# EAGLE design RF-INP-001 (EAGLE 9.6.2)
DOCNUM: RF-INP-001; DWBY: Lewis Russell; DWDATE: 2/2/2021; DWINIT: LR; REV: 001; TITLE: RF Amplfier Input Filter

## Sheet 1 of 4: System Architecture
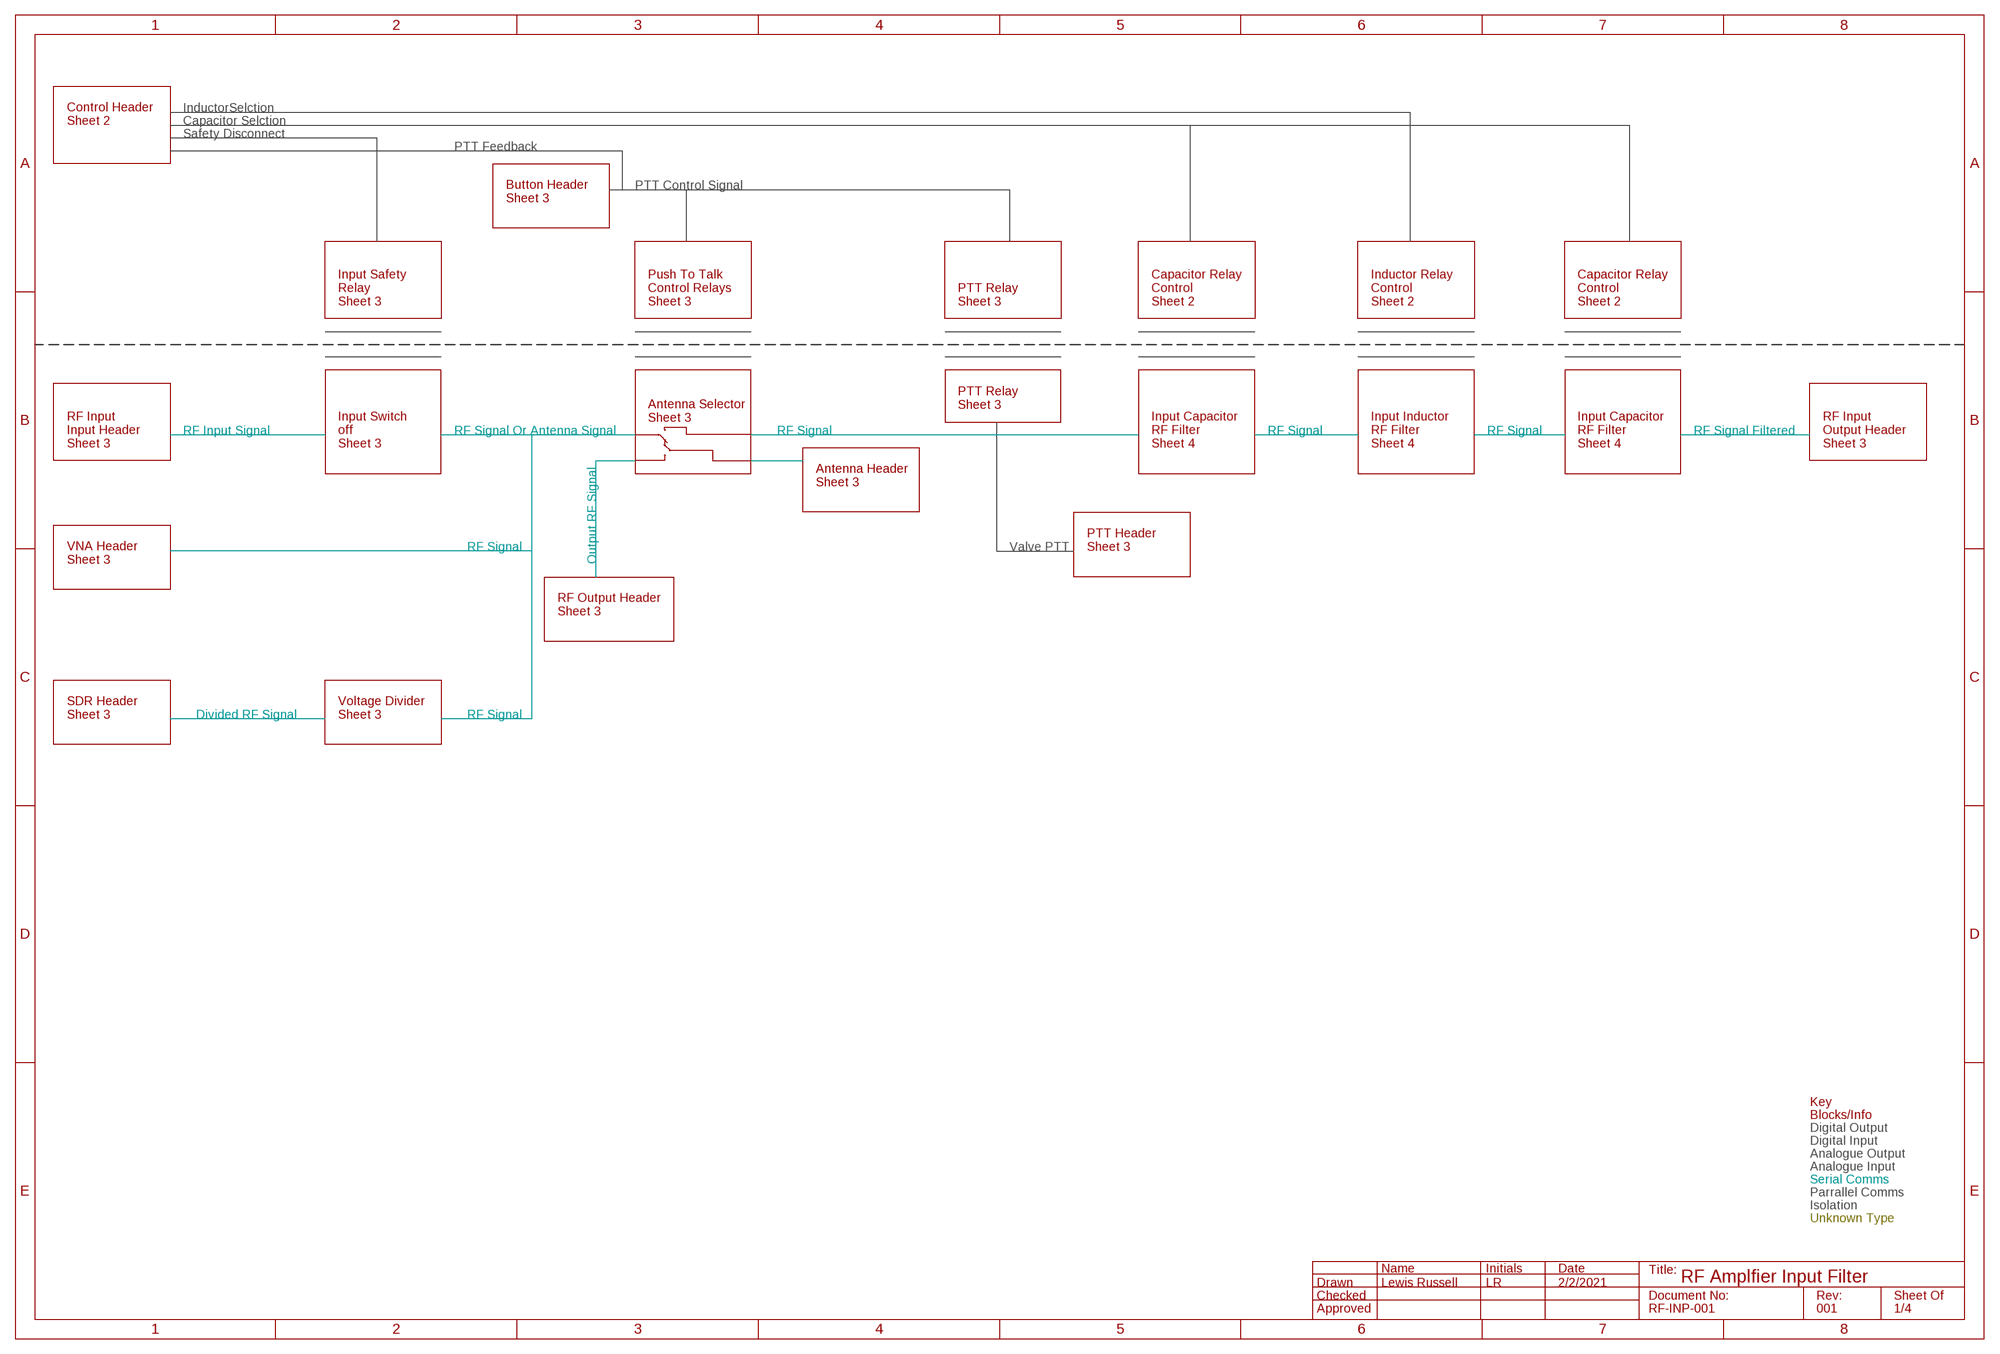
[diagram p0: schematic, sheet 1]

### Notes on the sheet
- InductorSelction
- Control Header
  Sheet 2
- Capacitor Selction
- Safety Disconnect
- PTT Feedback
- PTT Control Signal
- Button Header
  Sheet 3
- Input Safety
  Relay
  Sheet 3
- Push To Talk
  Control Relays
  Sheet 3
- PTT Relay
  Sheet 3
- Capacitor Relay
  Control
  Sheet 2
- Inductor Relay
  Control
  Sheet 2
- Capacitor Relay
  Control
  Sheet 2
- PTT Relay
  Sheet 3
- Antenna Selector
  Sheet 3
- RF Input Signal | RF Signal Or Antenna Signal | RF Signal | RF Signal | RF Signal | RF Signal Filtered
- RF Input 
  Input Header
  Sheet 3
- Input Switch
  off
  Sheet 3
- Input Capacitor
  RF Filter
  Sheet 4
- Input Inductor
  RF Filter
  Sheet 4
- Input Capacitor
  RF Filter
  Sheet 4
- RF Input
  Output Header
  Sheet 3
- Antenna Header
  Sheet 3
- RF Signal | Valve PTT
- PTT Header
  Sheet 3
- VNA Header
  Sheet 3
- Output RF Signal
- RF Output Header
  Sheet 3
- SDR Header
  Sheet 3
- Divided RF Signal
- Voltage Divider
  Sheet 3
- RF Signal
- Key
- Blocks/Info
- Digital Output
- Digital Input
- Analogue Output
- Analogue Input
- Serial Comms
- Parrallel Comms
- Isolation
- Unknown Type

## Sheet 2 of 4: Input Relay Control
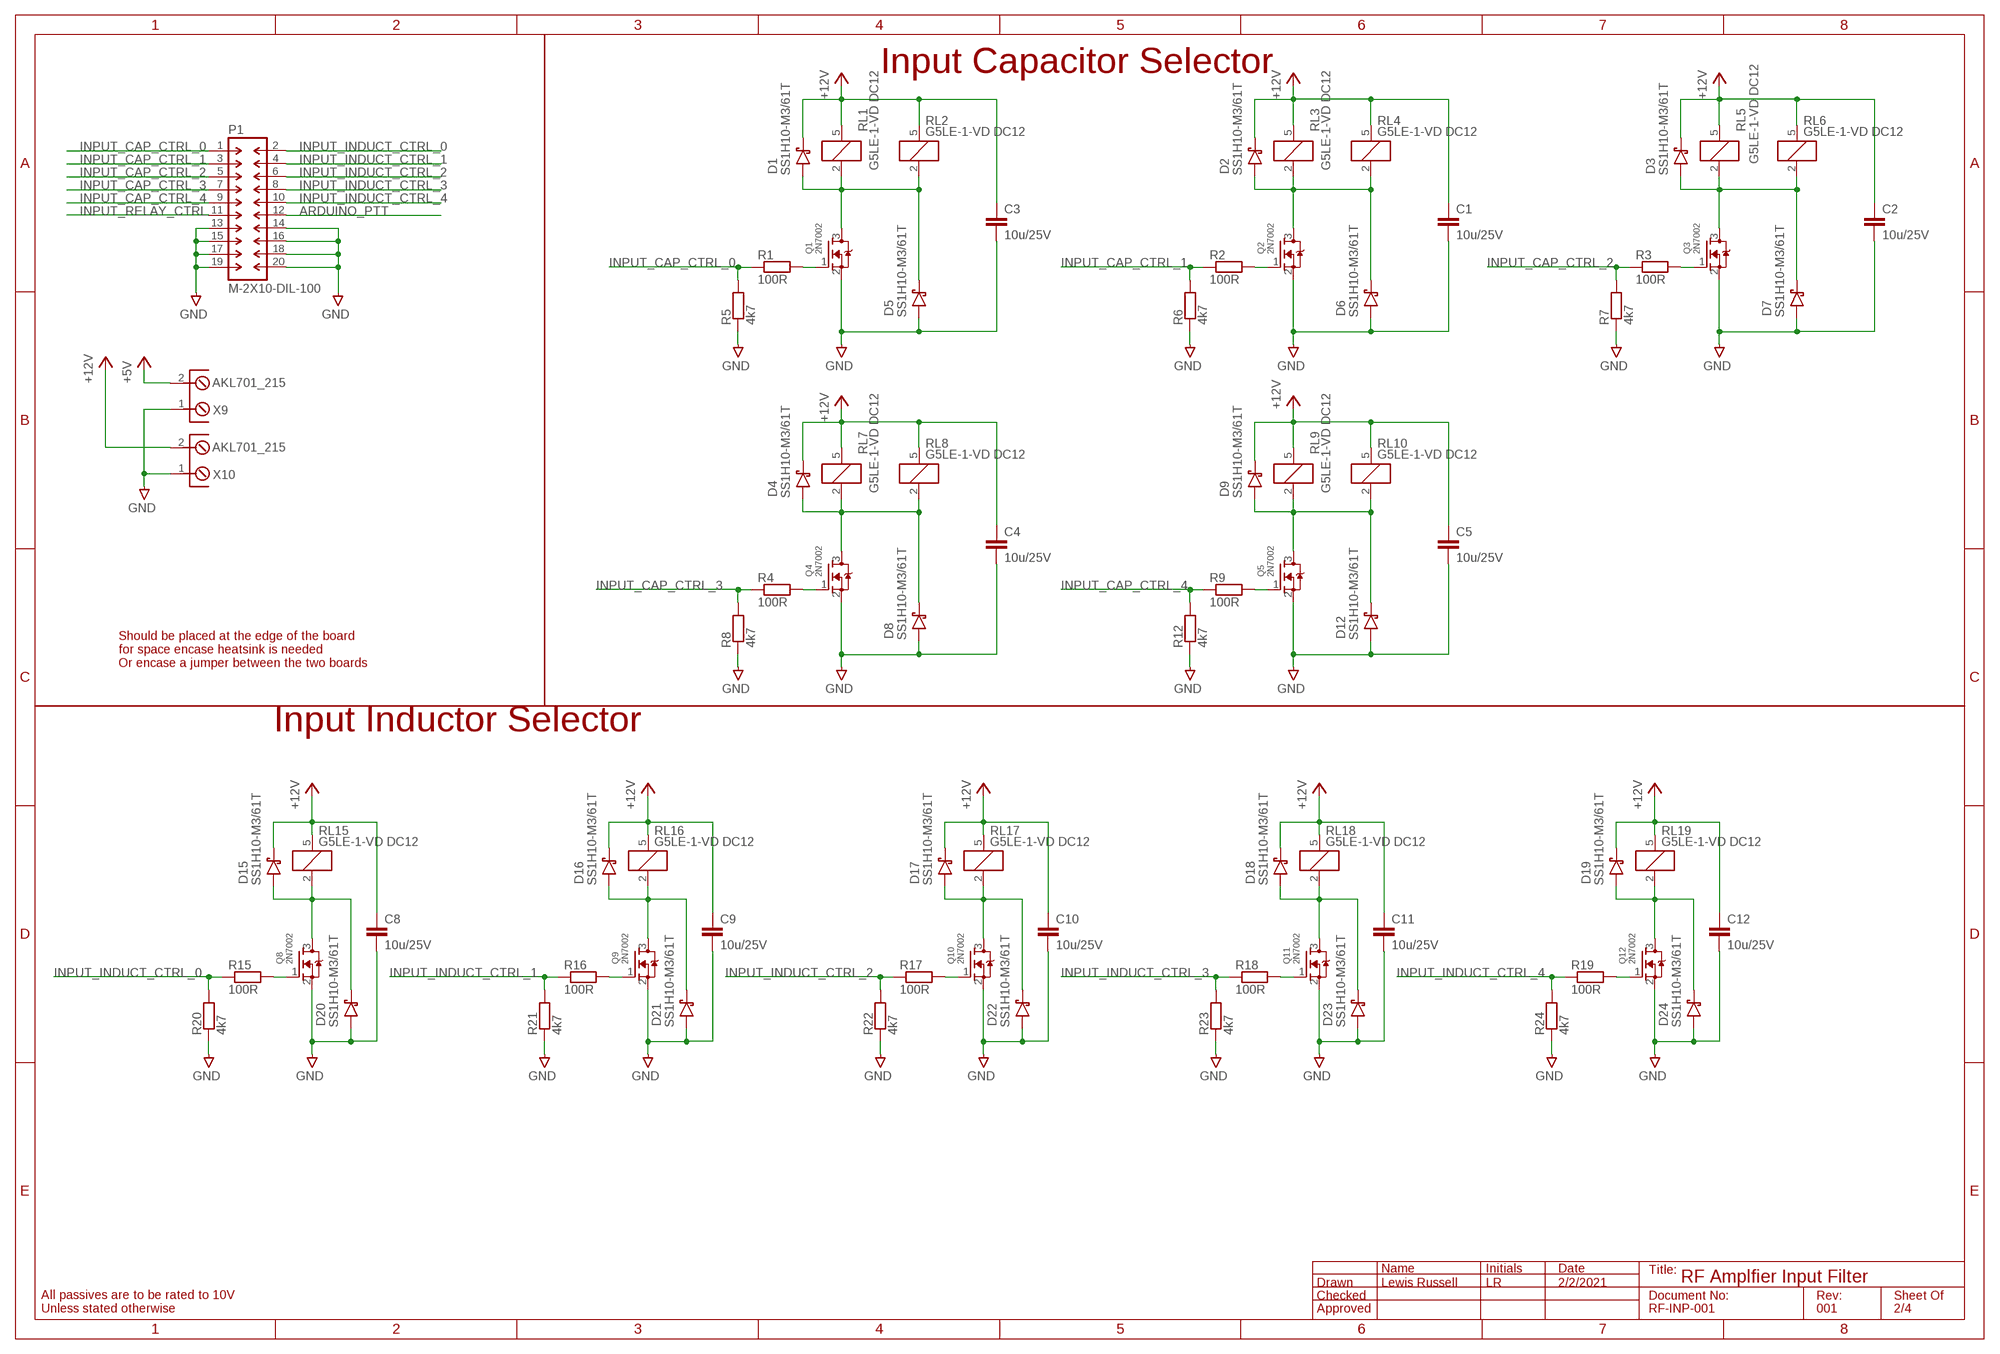
[diagram p1: schematic, sheet 2]

### Parts
C1  10u/25V  C-EUC0805  [C0805]
C2  10u/25V  C-EUC0805  [C0805]
C3  10u/25V  C-EUC0805  [C0805]
C4  10u/25V  C-EUC0805  [C0805]
C5  10u/25V  C-EUC0805  [C0805]
C8  10u/25V  C-EUC0805  [C0805]
C9  10u/25V  C-EUC0805  [C0805]
C10  10u/25V  C-EUC0805  [C0805]
C11  10u/25V  C-EUC0805  [C0805]
C12  10u/25V  C-EUC0805  [C0805]
D1  SS1H10-M3/61T  SCHOTTKY_DIODESMA  [SMA/DO-214AC]
D2  SS1H10-M3/61T  SCHOTTKY_DIODESMA  [SMA/DO-214AC]
D3  SS1H10-M3/61T  SCHOTTKY_DIODESMA  [SMA/DO-214AC]
D4  SS1H10-M3/61T  SCHOTTKY_DIODESMA  [SMA/DO-214AC]
D5  SS1H10-M3/61T  SCHOTTKY_DIODESMA  [SMA/DO-214AC]
D6  SS1H10-M3/61T  SCHOTTKY_DIODESMA  [SMA/DO-214AC]
D7  SS1H10-M3/61T  SCHOTTKY_DIODESMA  [SMA/DO-214AC]
D8  SS1H10-M3/61T  SCHOTTKY_DIODESMA  [SMA/DO-214AC]
D9  SS1H10-M3/61T  SCHOTTKY_DIODESMA  [SMA/DO-214AC]
D12  SS1H10-M3/61T  SCHOTTKY_DIODESMA  [SMA/DO-214AC]
D15  SS1H10-M3/61T  SCHOTTKY_DIODESMA  [SMA/DO-214AC]
D16  SS1H10-M3/61T  SCHOTTKY_DIODESMA  [SMA/DO-214AC]
D17  SS1H10-M3/61T  SCHOTTKY_DIODESMA  [SMA/DO-214AC]
D18  SS1H10-M3/61T  SCHOTTKY_DIODESMA  [SMA/DO-214AC]
D19  SS1H10-M3/61T  SCHOTTKY_DIODESMA  [SMA/DO-214AC]
D20  SS1H10-M3/61T  SCHOTTKY_DIODESMA  [SMA/DO-214AC]
D21  SS1H10-M3/61T  SCHOTTKY_DIODESMA  [SMA/DO-214AC]
D22  SS1H10-M3/61T  SCHOTTKY_DIODESMA  [SMA/DO-214AC]
D23  SS1H10-M3/61T  SCHOTTKY_DIODESMA  [SMA/DO-214AC]
D24  SS1H10-M3/61T  SCHOTTKY_DIODESMA  [SMA/DO-214AC]
P1  M-2X10-DIL-100  [DIL-100-2X10]
Q1  2N7002  MOSFET-NREFLOW  [SOT23]
Q2  2N7002  MOSFET-NREFLOW  [SOT23]
Q3  2N7002  MOSFET-NREFLOW  [SOT23]
Q4  2N7002  MOSFET-NREFLOW  [SOT23]
Q5  2N7002  MOSFET-NREFLOW  [SOT23]
Q8  2N7002  MOSFET-NREFLOW  [SOT23]
Q9  2N7002  MOSFET-NREFLOW  [SOT23]
Q10  2N7002  MOSFET-NREFLOW  [SOT23]
Q11  2N7002  MOSFET-NREFLOW  [SOT23]
Q12  2N7002  MOSFET-NREFLOW  [SOT23]
R1  100R  R-EUR0603  [R0603]
R2  100R  R-EUR0603  [R0603]
R3  100R  R-EUR0603  [R0603]
R4  100R  R-EUR0603  [R0603]
R5  4k7  R-EUR0603  [R0603]
R6  4k7  R-EUR0603  [R0603]
R7  4k7  R-EUR0603  [R0603]
R8  4k7  R-EUR0603  [R0603]
R9  100R  R-EUR0603  [R0603]
R12  4k7  R-EUR0603  [R0603]
R15  100R  R-EUR0603  [R0603]
R16  100R  R-EUR0603  [R0603]
R17  100R  R-EUR0603  [R0603]
R18  100R  R-EUR0603  [R0603]
R19  100R  R-EUR0603  [R0603]
R20  4k7  R-EUR0603  [R0603]
R21  4k7  R-EUR0603  [R0603]
R22  4k7  R-EUR0603  [R0603]
R23  4k7  R-EUR0603  [R0603]
R24  4k7  R-EUR0603  [R0603]
RL1  G5LE-1-VD DC12  G5LE-E  [SPDT]
RL2  G5LE-1-VD DC12  G5LE-E  [SPDT]
RL3  G5LE-1-VD DC12  G5LE-E  [SPDT]
RL4  G5LE-1-VD DC12  G5LE-E  [SPDT]
RL5  G5LE-1-VD DC12  G5LE-E  [SPDT]
RL6  G5LE-1-VD DC12  G5LE-E  [SPDT]
RL7  G5LE-1-VD DC12  G5LE-E  [SPDT]
RL8  G5LE-1-VD DC12  G5LE-E  [SPDT]
RL9  G5LE-1-VD DC12  G5LE-E  [SPDT]
RL10  G5LE-1-VD DC12  G5LE-E  [SPDT]
RL15  G5LE-1-VD DC12  G5LE-E  [SPDT]
RL16  G5LE-1-VD DC12  G5LE-E  [SPDT]
RL17  G5LE-1-VD DC12  G5LE-E  [SPDT]
RL18  G5LE-1-VD DC12  G5LE-E  [SPDT]
RL19  G5LE-1-VD DC12  G5LE-E  [SPDT]
X9  AKL701_215  [AKL701_2_15]
X10  AKL701_215  [AKL701_2_15]

### Nets
+5V [GND Signal]: X9.2 ; also sheet 3
+12V [GND Signal]: C1.1 C2.1 C3.1 C4.1 C5.1 C8.1 C9.1 C10.1 C11.1 C12.1 D1.C(CATHODE) D2.C(CATHODE) D3.C(CATHODE) D4.C(CATHODE) D9.C(CATHODE) D15.C(CATHODE) D16.C(CATHODE) D17.C(CATHODE) D18.C(CATHODE) D19.C(CATHODE) RL1.5 RL2.5 RL3.5 RL4.5 RL5.5 RL6.5 RL7.5 RL8.5 RL9.5 RL10.5 RL15.5 RL16.5 RL17.5 RL18.5 RL19.5 X10.2 ; also sheet 3
ARDUINO_PTT [GND Signal]: P1.12 ; also sheet 3
GND [GND Signal]: C1.2 C2.2 C3.2 C4.2 C5.2 C8.2 C9.2 C10.2 C11.2 C12.2 D5.A(ANODE) D6.A(ANODE) D7.A(ANODE) D8.A(ANODE) D12.A(ANODE) D20.A(ANODE) D21.A(ANODE) D22.A(ANODE) D23.A(ANODE) D24.A(ANODE) P1.13 P1.14 P1.15 P1.16 P1.17 P1.18 P1.19 P1.20 Q1.2(S) Q2.2(S) Q3.2(S) Q4.2(S) Q5.2(S) Q8.2(S) Q9.2(S) Q10.2(S) Q11.2(S) Q12.2(S) R5.1 R6.1 R7.1 R8.1 R12.1 R20.1 R21.1 R22.1 R23.1 R24.1 X9.1 X10.1 ; also sheet 3
INPUT_CAP_CTRL_0 [GND Signal]: P1.1 R1.1 R5.2
INPUT_CAP_CTRL_1 [GND Signal]: P1.3 R2.1 R6.2
INPUT_CAP_CTRL_2 [GND Signal]: P1.5 R3.1 R7.2
INPUT_CAP_CTRL_3 [GND Signal]: P1.7 R4.1 R8.2
INPUT_CAP_CTRL_4 [GND Signal]: P1.9 R9.1 R12.2
INPUT_INDUCT_CTRL_0 [GND Signal]: P1.2 R15.1 R20.2
INPUT_INDUCT_CTRL_1 [GND Signal]: P1.4 R16.1 R21.2
INPUT_INDUCT_CTRL_2 [GND Signal]: P1.6 R17.1 R22.2
INPUT_INDUCT_CTRL_3 [GND Signal]: P1.8 R18.1 R23.2
INPUT_INDUCT_CTRL_4 [GND Signal]: P1.10 R19.1 R24.2
INPUT_RELAY_CTRL [GND Signal]: P1.11 ; also sheet 3
N$53 [GND Signal]: D16.A(ANODE) D21.C(CATHODE) Q9.3(D) RL16.2
N$64 [GND Signal]: Q9.1(G) R16.2
N$67 [GND Signal]: D17.A(ANODE) D22.C(CATHODE) Q10.3(D) RL17.2
N$80 [GND Signal]: Q10.1(G) R17.2
N$102 [GND Signal]: D18.A(ANODE) D23.C(CATHODE) Q11.3(D) RL18.2
N$111 [GND Signal]: Q11.1(G) R18.2
N$114 [GND Signal]: D19.A(ANODE) D24.C(CATHODE) Q12.3(D) RL19.2
N$115 [GND Signal]: Q12.1(G) R19.2
N$120 [GND Signal]: D1.A(ANODE) D5.C(CATHODE) Q1.3(D) RL1.2 RL2.2
N$121 [GND Signal]: Q1.1(G) R1.2
N$142 [GND Signal]: D2.A(ANODE) D6.C(CATHODE) Q2.3(D) RL3.2 RL4.2
N$143 [GND Signal]: Q2.1(G) R2.2
N$144 [GND Signal]: D4.A(ANODE) D8.C(CATHODE) Q4.3(D) RL7.2 RL8.2
N$145 [GND Signal]: Q4.1(G) R4.2
N$146 [GND Signal]: D9.A(ANODE) D12.C(CATHODE) Q5.3(D) RL9.2 RL10.2
N$147 [GND Signal]: Q5.1(G) R9.2
N$152 [GND Signal]: D3.A(ANODE) D7.C(CATHODE) Q3.3(D) RL5.2 RL6.2
N$153 [GND Signal]: Q3.1(G) R3.2
N$164 [GND Signal]: D15.A(ANODE) D20.C(CATHODE) Q8.3(D) RL15.2
N$169 [GND Signal]: Q8.1(G) R15.2

### Notes on the sheet
- Input Capacitor Selector
- Should be placed at the edge of the board
  for space encase heatsink is needed
  Or encase a jumper between the two boards
- Input Inductor Selector
- All passives are to be rated to 10V
  Unless stated otherwise

## Sheet 3 of 4: Input Stage
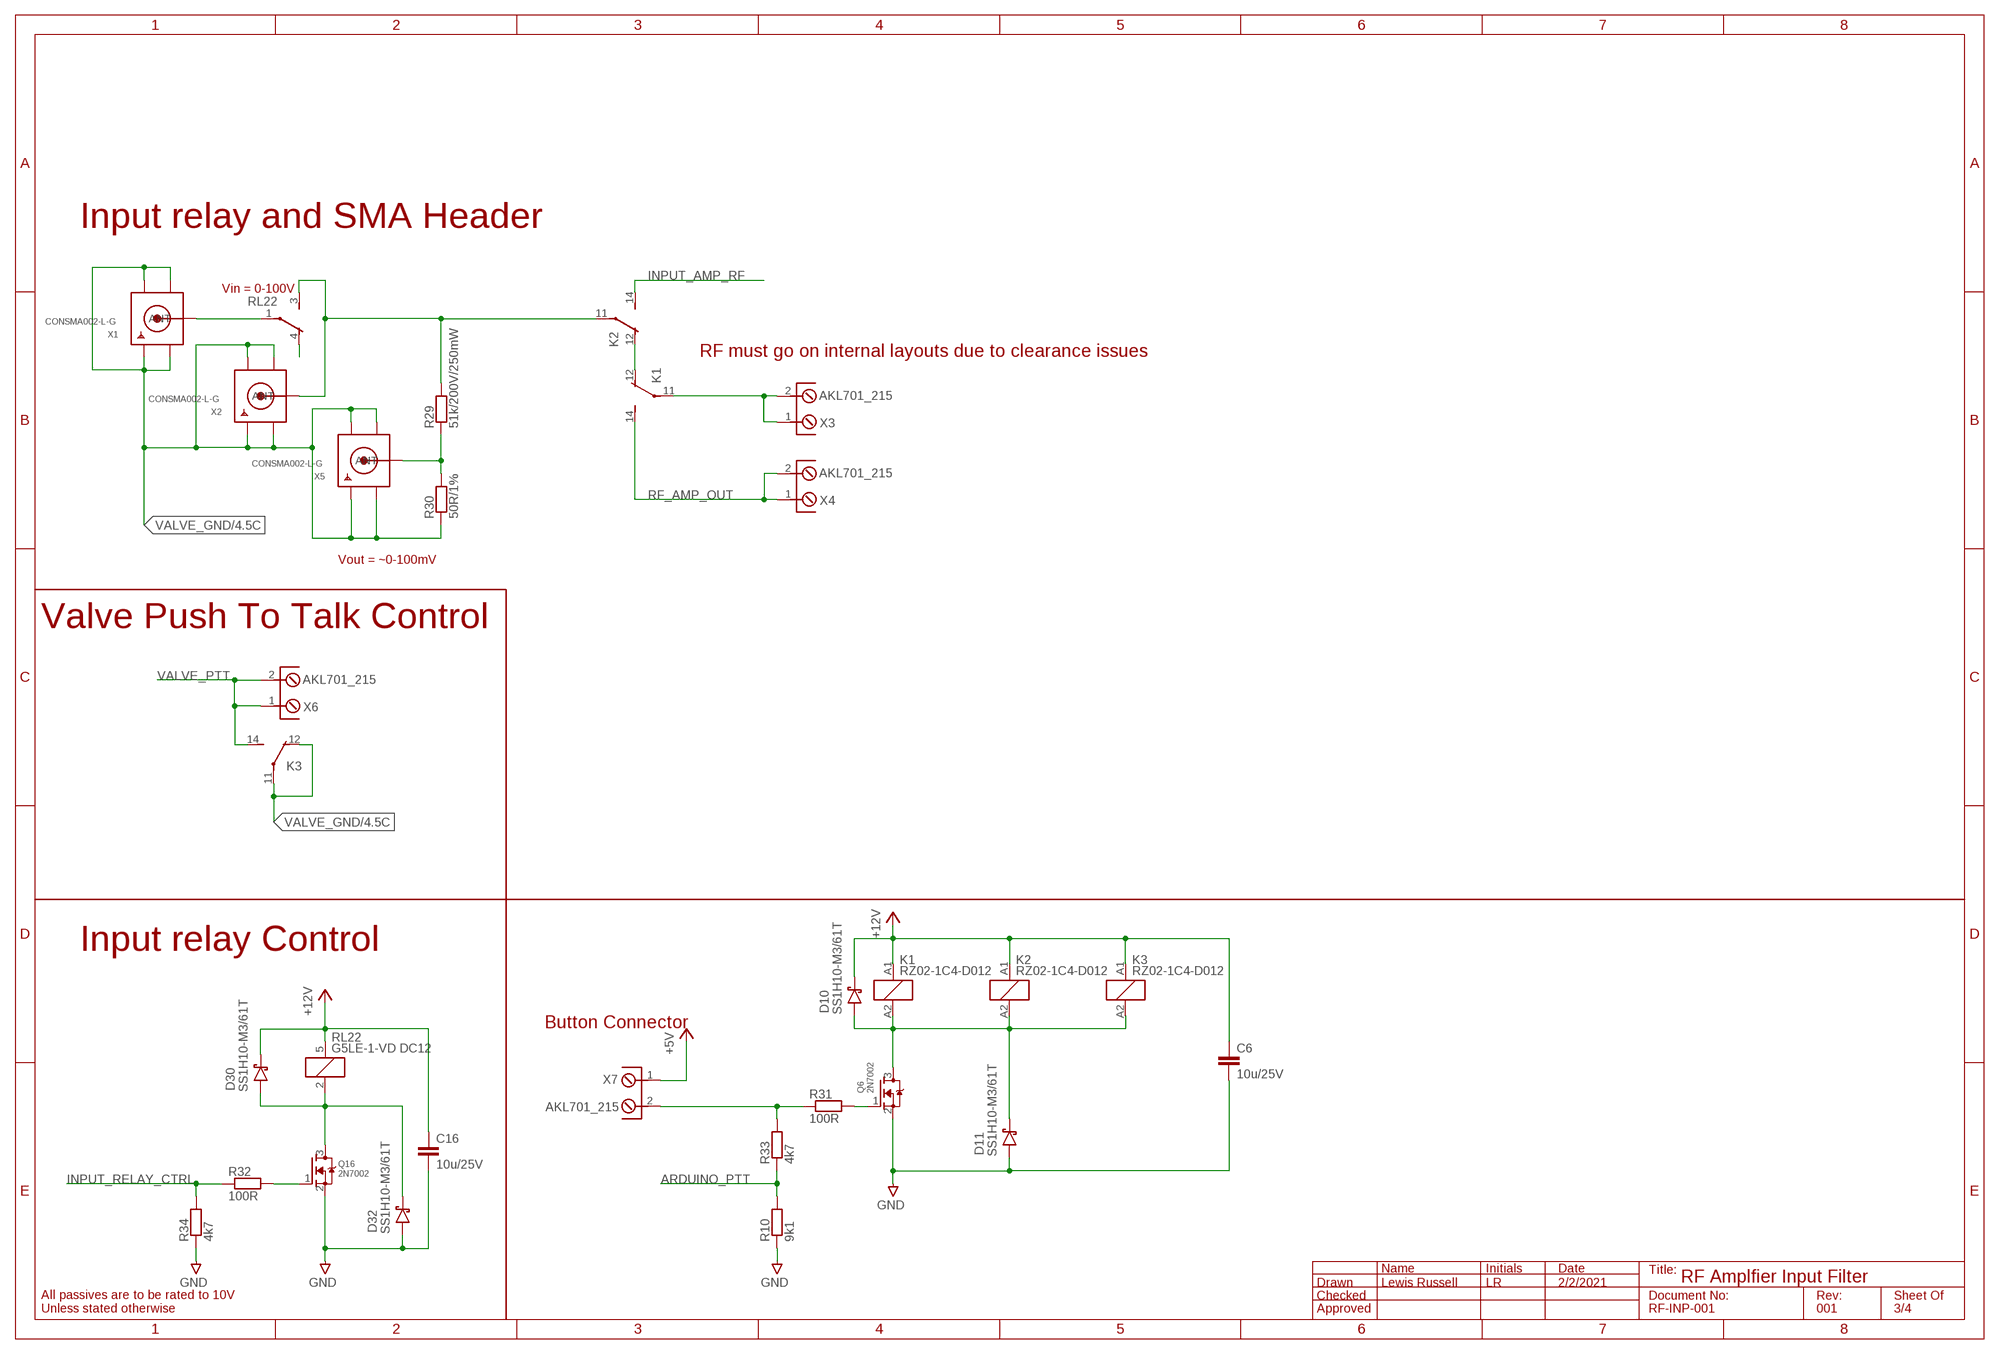
[diagram p2: schematic, sheet 3]

### Parts
C6  10u/25V  C-EUC0805  [C0805]
C16  10u/25V  C-EUC0805  [C0805]
D10  SS1H10-M3/61T  SCHOTTKY_DIODESMA  [SMA/DO-214AC]
D11  SS1H10-M3/61T  SCHOTTKY_DIODESMA  [SMA/DO-214AC]
D30  SS1H10-M3/61T  SCHOTTKY_DIODESMA  [SMA/DO-214AC]
D32  SS1H10-M3/61T  SCHOTTKY_DIODESMA  [SMA/DO-214AC]
K1  RZ02-1C4-D012  RZ02-1C  [12A-5MM]
K2  RZ02-1C4-D012  RZ02-1C  [12A-5MM]
K3  RZ02-1C4-D012  RZ02-1C  [12A-5MM]
Q6  2N7002  MOSFET-NREFLOW  [SOT23]
Q16  2N7002  MOSFET-NREFLOW  [SOT23]
R10  9k1  R-EUR0603  [R0603]
R29  51k/200V/250mW  R-EUR2512  [R2512]
R30  50R/1%  R-EUR0603  [R0603]
R31  100R  R-EUR0603  [R0603]
R32  100R  R-EUR0603  [R0603]
R33  4k7  R-EUR0603  [R0603]
R34  4k7  R-EUR0603  [R0603]
RL22  G5LE-1-VD DC12  G5LE-E  [SPDT]
X1  CONSMA002-L-G  SMACONNECTOR  [SMA90_DIP]
X2  CONSMA002-L-G  SMACONNECTOR  [SMA90_DIP]
X3  AKL701_215  [AKL701_2_15]
X4  AKL701_215  [AKL701_2_15]
X5  CONSMA002-L-G  SMACONNECTOR  [SMA90_DIP]
X6  AKL701_215  [AKL701_2_15]
X7  AKL701_215  [AKL701_2_15]

### Nets
+5V [GND Signal]: X7.1 ; also sheet 2
+12V [GND Signal]: C6.1 C16.1 D10.C(CATHODE) D30.C(CATHODE) K1.A1 K2.A1 K3.A1 RL22.5 ; also sheet 2
ARDUINO_PTT [GND Signal]: R10.2 R33.1 ; also sheet 2
GND [GND Signal]: C6.2 C16.2 D11.A(ANODE) D32.A(ANODE) Q6.2(S) Q16.2(S) R10.1 R34.1 ; also sheet 2
INPUT_AMP_RF [RF]: K2.14(NO) ; also sheet 4
INPUT_RELAY_CTRL [GND Signal]: R32.1 R34.2 ; also sheet 2
N$1 [GND Signal]: D10.A(ANODE) D11.C(CATHODE) K1.A2 K2.A2 K3.A2 Q6.3(D)
N$2 [HV_RF]: K1.12(NC) K2.12(NC)
N$3 [HV_RF]: K1.11(COM) X3.1 X3.2
N$4 [RF]: RL22.4
N$5 [GND Signal]: Q6.1(G) R31.2
N$15 [GND Signal]: D30.A(ANODE) D32.C(CATHODE) Q16.3(D) RL22.2
N$29 [GND Signal]: Q16.1(G) R32.2
N$33 [RF]: R29.1 R30.2 X5.ANTENNA(ANT)
N$101 [RF]: RL22.1 X1.ANTENNA(ANT)
N$187 [GND Signal]: R31.1 R33.2 X7.2
N$190 [RF]: K2.11(COM) R29.2 RL22.3 X2.ANTENNA(ANT)
RF_AMP_OUT [HV_RF]: K1.14(NO) X4.1 X4.2
VALVE_GND [HV GND]: K3.11(COM) K3.12(NC) R30.1 X1.GND1 X1.GND2 X1.GND3 X1.GND4 X2.GND1 X2.GND2 X2.GND3 X2.GND4 X5.GND1 X5.GND2 X5.GND3 X5.GND4 ; also sheet 4
VALVE_PTT [RF]: K3.14(NO) X6.1 X6.2

### Notes on the sheet
- Input relay and SMA Header
- Vin = 0-100V
- RF must go on internal layouts due to clearance issues
- Vout = ~0-100mV
- Valve Push To Talk Control
- Input relay Control
- Button Connector
- All passives are to be rated to 10V
  Unless stated otherwise

## Sheet 4 of 4: RF Input Filter
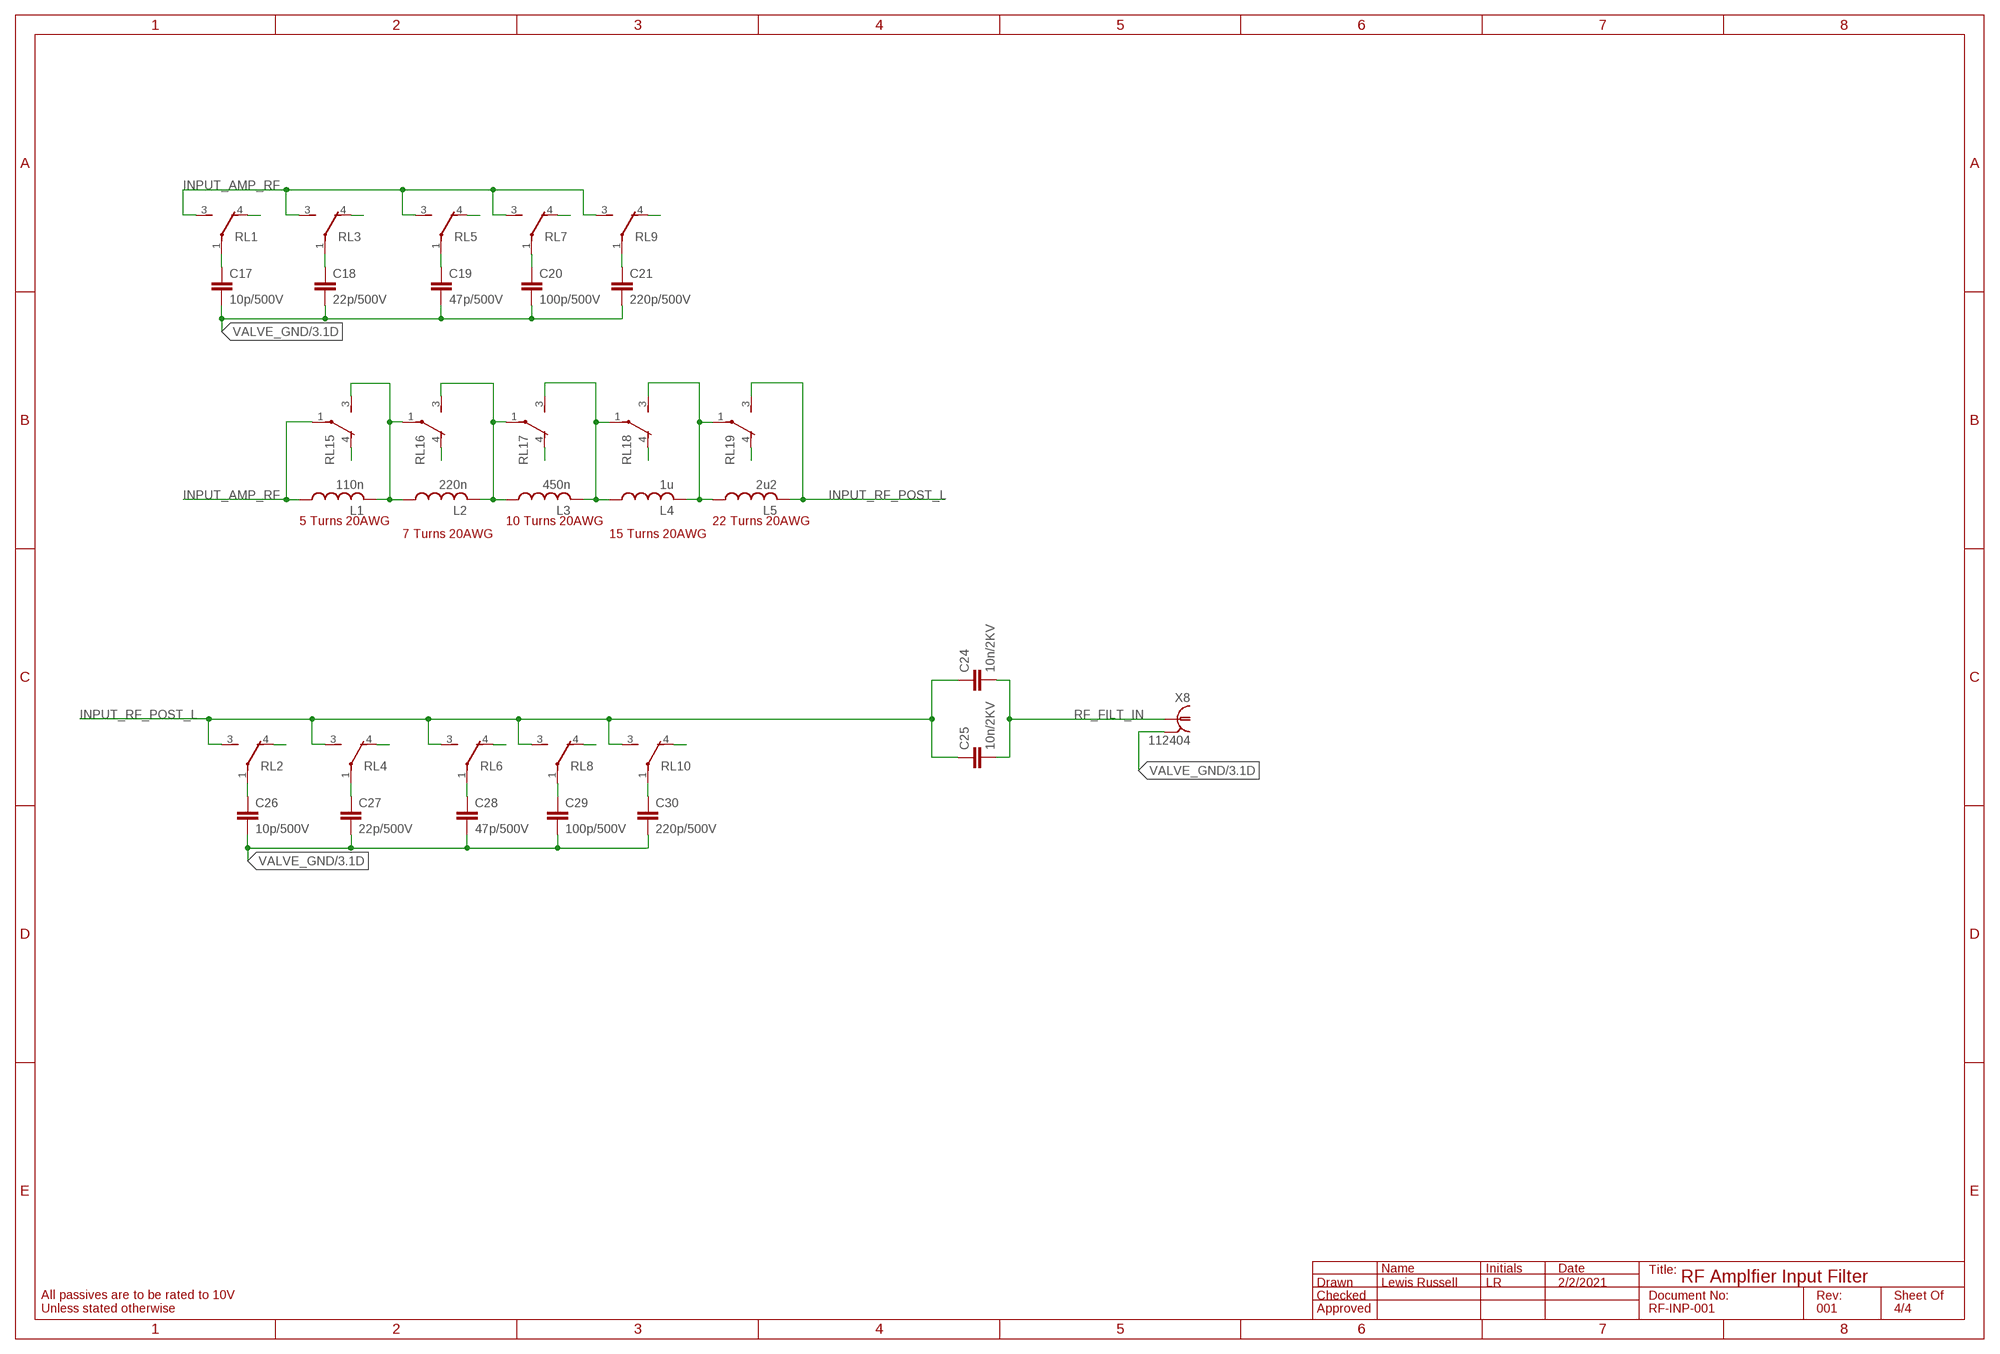
[diagram p3: schematic, sheet 4]

### Parts
C17  10p/500V  C-EUC1812  [C1812]
C18  22p/500V  C-EUC1812  [C1812]
C19  47p/500V  C-EUC1812  [C1812]
C20  100p/500V  C-EUC1812  [C1812]
C21  220p/500V  C-EUC1812  [C1812]
C24  10n/2KV  C-EUC1812  [C1812]
C25  10n/2KV  C-EUC1812  [C1812]
C26  10p/500V  C-EUC1812  [C1812]
C27  22p/500V  C-EUC1812  [C1812]
C28  47p/500V  C-EUC1812  [C1812]
C29  100p/500V  C-EUC1812  [C1812]
C30  220p/500V  C-EUC1812  [C1812]
L1  110n  T80-6  [T80-6]
L2  220n  T80-6  [T80-6]
L3  450n  T80-6  [T80-6]
L4  1u  T80-6  [T80-6]
L5  2u2  T80-6  [T80-6]
X8  112404  [112404]

### Nets
INPUT_AMP_RF [RF]: L1.1 RL1.3 RL3.3 RL5.3 RL7.3 RL9.3 RL15.1 ; also sheet 3
INPUT_RF_POST_L [RF]: C24.1 C25.1 L5.2 RL2.3 RL4.3 RL6.3 RL8.3 RL10.3 RL19.3
N$6 [RF]: RL1.4
N$7 [RF]: RL3.4
N$8 [RF]: RL5.4
N$9 [RF]: RL7.4
N$10 [RF]: RL9.4
N$11 [RF]: RL2.4
N$12 [RF]: RL4.4
N$13 [RF]: RL6.4
N$14 [RF]: RL8.4
N$16 [RF]: RL10.4
N$17 [RF]: RL15.4
N$18 [RF]: RL16.4
N$19 [RF]: RL17.4
N$20 [RF]: RL18.4
N$21 [RF]: RL19.4
N$100 [RF]: C17.1 RL1.1
N$103 [RF]: C26.1 RL2.1
N$107 [RF]: C27.1 RL4.1
N$108 [RF]: C28.1 RL6.1
N$109 [RF]: C29.1 RL8.1
N$110 [RF]: C30.1 RL10.1
N$151 [RF]: C18.1 RL3.1
N$167 [RF]: C19.1 RL5.1
N$168 [RF]: C21.1 RL9.1
N$302 [RF]: C20.1 RL7.1
N$321 [RF]: L4.2 L5.1 RL18.3 RL19.1
N$322 [RF]: L3.2 L4.1 RL17.3 RL18.1
N$332 [RF]: L2.2 L3.1 RL16.3 RL17.1
N$333 [RF]: L1.2 L2.1 RL15.3 RL16.1
RF_FILT_IN [RF]: C24.2 C25.2 X8.1
VALVE_GND [HV GND]: C17.2 C18.2 C19.2 C20.2 C21.2 C26.2 C27.2 C28.2 C29.2 C30.2 X8.2 X8.3 X8.4 X8.5 ; also sheet 3

### Notes on the sheet
- 5 Turns 20AWG | 10 Turns 20AWG | 22 Turns 20AWG
- 7 Turns 20AWG | 15 Turns 20AWG
- All passives are to be rated to 10V
  Unless stated otherwise

## Library data of the parts
C1-C6 C8-C12 C16-C21 C24-C30 = Mage-Control:C-EU: CAPACITOR, European symbol
D1-D12 D15-D24 D30 D32 = DO-214 Diodes:SCHOTTKY_DIODE: DO-214 package regular diode Varients SMA = DO-214AC SMB = DO-214AA SMC = DO-214AB Made By: Lewis Russell 29/6/2020 Checked By: Fraser Douglas 29/6/2020
K1-K3 = Power PCB Relay RZ:RZ: TE Connectivity Power PCB Relay RZ Serries Naming Convension RZ 0 3 -1C 4 -D012 R RZ = Series name:- RZ 0 = Version:- 0= Standard Version, R = Reflow version 1 = Package:- 12A 3.5mm pinning, 2 = 12A, 5mm pinning, 3 = 16mm double pinning, H = High Performance 5mm double pinning 1C = Contact configuration:- 1C = Form A SPDT, 1A SPST NO 4 = Contact Material:- 4 = AgNi p0/10, 3 = AgSnO2 -DC012 = Coil Version/voltage = D003, D005, D006, D009, D012, D015, D024, D048 R = Cover version:- blank = standard, R = renforced flux proof and plug in capable (only AgNi contact versions) Made By: Lewis Russell 24/2/21 Checked By:
L1-L5 = Custom Inductor:T80-6: T80 Inductor Core Made By: Lewis Russe;; 10/2/21 Checked By:
P1 = con-headers-jp:M-2X10-: MALE HEADER
Q1-Q6 Q8-Q12 Q16 = adafruit:MOSFET-N: N-Channel Mosfet 2N7002E - 60V 260mA SOT23 [Digikey: 2N7002ET1GOSTR-ND] - REEL BSH103 - 30V 850mA SOT23 [Digikey: 568-5013-1-ND]
R1-R10 R12 R15-R24 R29-R34 = Mage-Control:R-EU: RESISTOR, European symbol
RL1-RL10 RL15-RL19 RL22 = g5le-e:G5LE-E
X1 X2 X5 = adafruit:SMACONNECTOR: SMA Connector 90° DIP SMA Connector, 50 Ohm (4UConnector: 07259)
X3 X4 X6 X7 X9 X10 = _con_riacon_akl701:AKL701_2*: RIACON (Ria Connect) Screw Type Terminal Block Type AKL 701 - 2 (pole-size: 2) centerline 6.35 mm / 0.250 inches, 400 V / 24 A, horizontal wire entry, lift system, modular packages: _13: recommended pcb hole dia. = 1,3 mm _15: pcb hole dia. = 1,5 mm (prototyping) Auhtor: Dipl.-Ing. FH Rainer Bayer, Hochschule Heilbronn (rainer.bayer@hs-heilbronn.de)
X8 = amphenol-112404_10:112404: Amphenol Connex 112404 BNC P. C. Mount Recept. Jack Source: http://www.amphenolconnex.com/media/downloads/3157/112404.pdf; MF: Amphenol Connex; MPN: 112404; OC_FARNELL: 1583381; OC_NEWARK: 99H4363

## Net classes
0 default: width 1 mm, drill 1 mm, clearance 1 mm
1 GND Signal: width 0.2 mm, drill 0.4 mm, clearance 1 mm to class 0, clearance 0.13 mm
2 RF: width 0.2 mm, drill 0.4 mm, clearance 1 mm to class 0, clearance 3.2 mm to class 1, clearance 1 mm
3 HV: width 0.2 mm, drill 0.4 mm, clearance 1 mm to class 0, clearance 14.525 mm to class 1, clearance 14.525 mm to class 2, clearance 14.525 mm
4 HV GND: width 0.2 mm, drill 0.4 mm, clearance 1 mm to class 0, clearance 3.2 mm to class 1, clearance 0.5 mm to class 2, clearance 14.525 mm to class 3, clearance 0.13 mm
5 HV_RF: width 0.2 mm, drill 0.4 mm, clearance 1 mm to class 0, clearance 6.5 mm to class 1, clearance 6.5 mm to class 2, clearance 14.525 mm to class 3, clearance 6.5 mm to class 4, clearance 6.5 mm

## Board
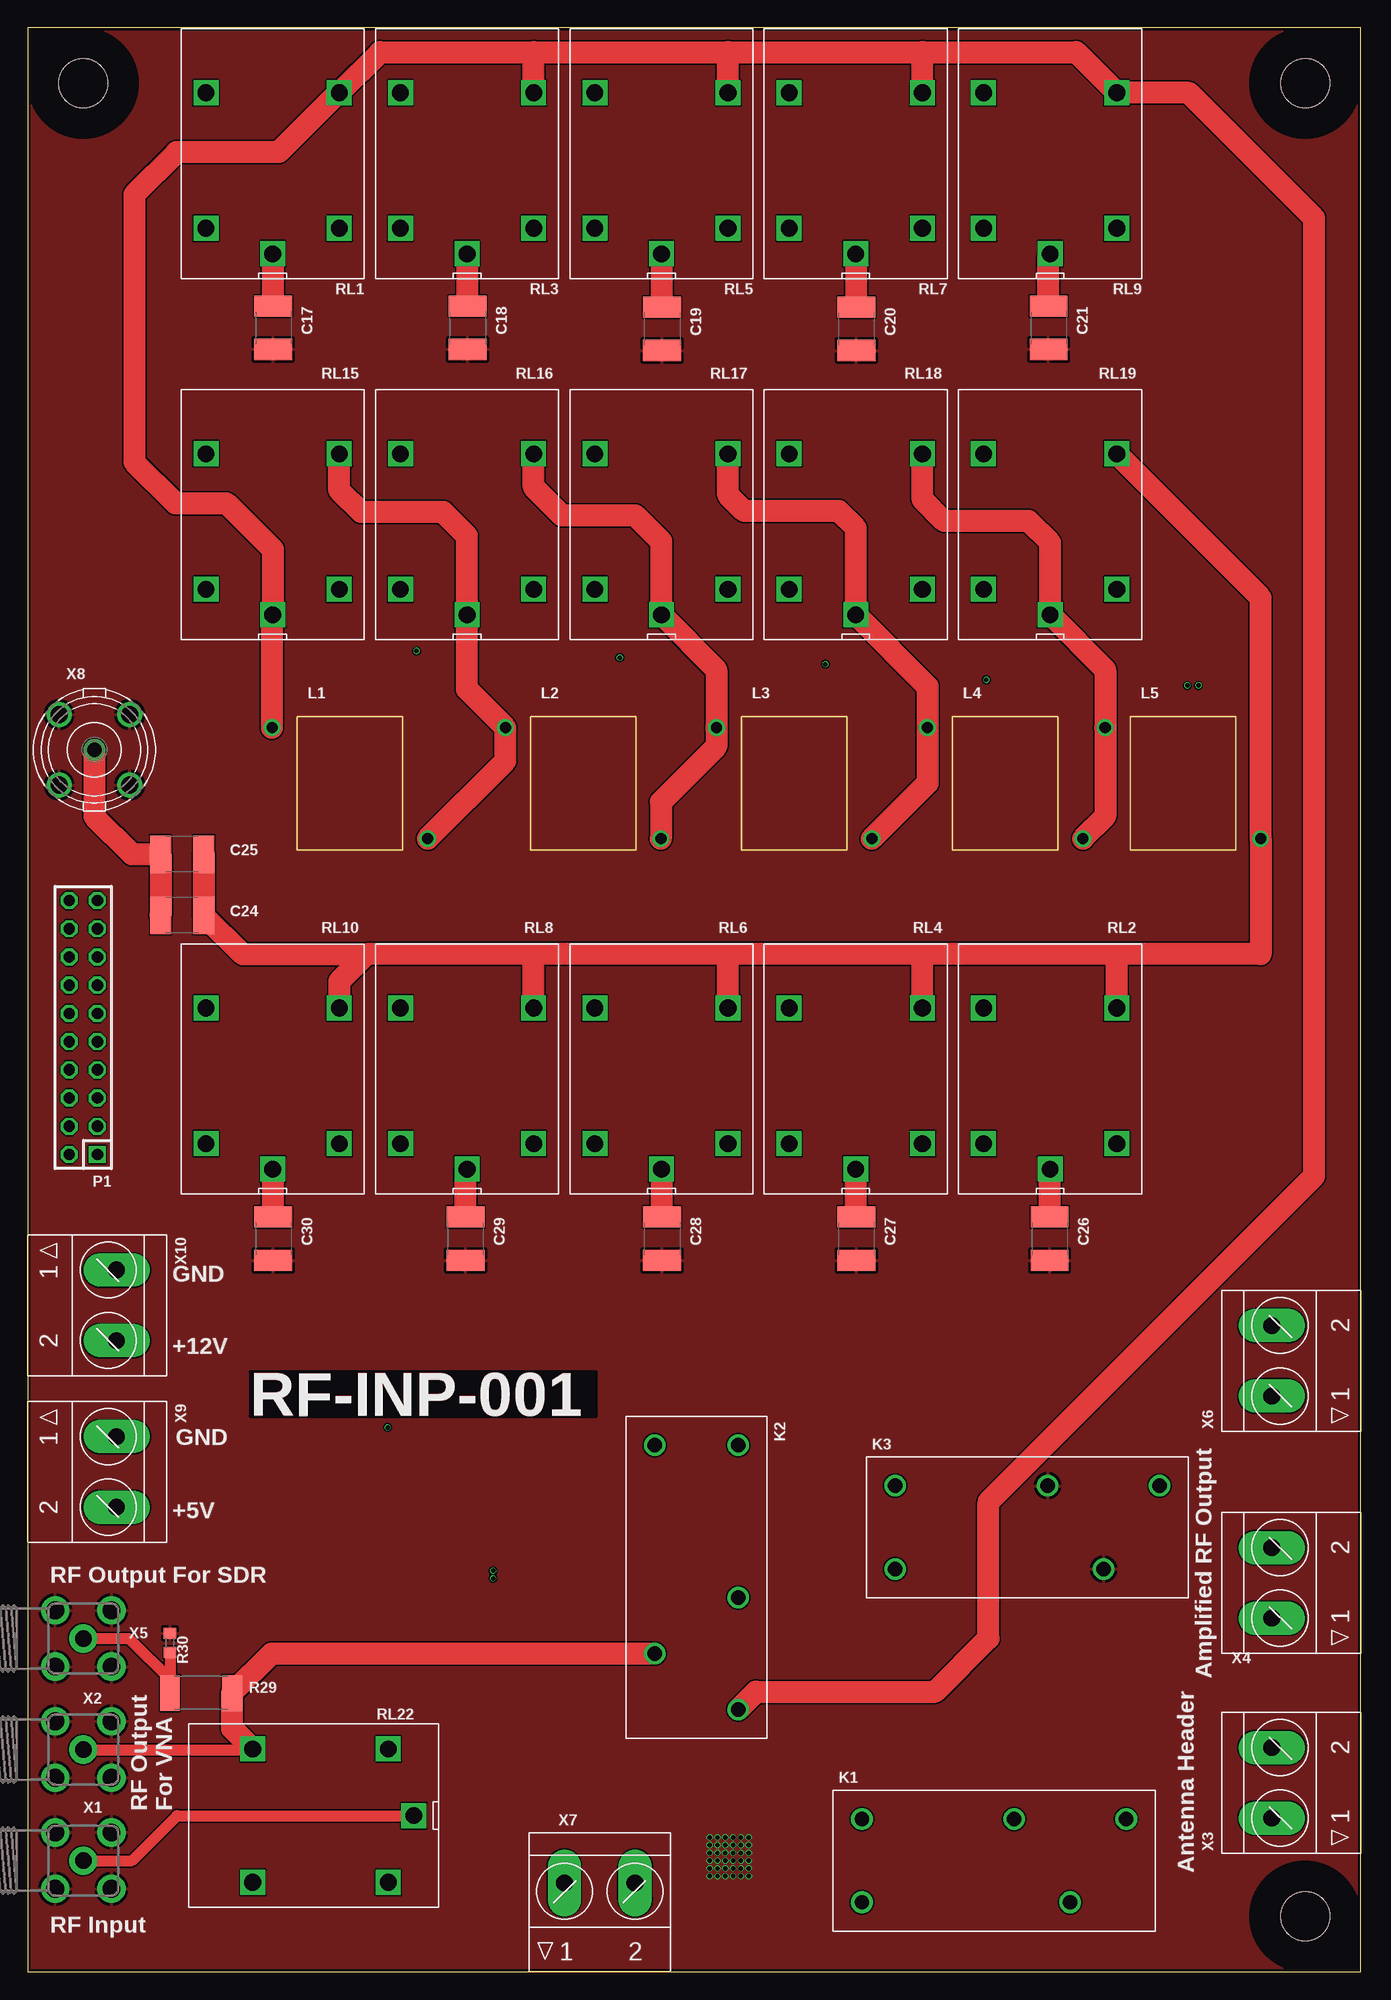
[diagram p4: board, top side]
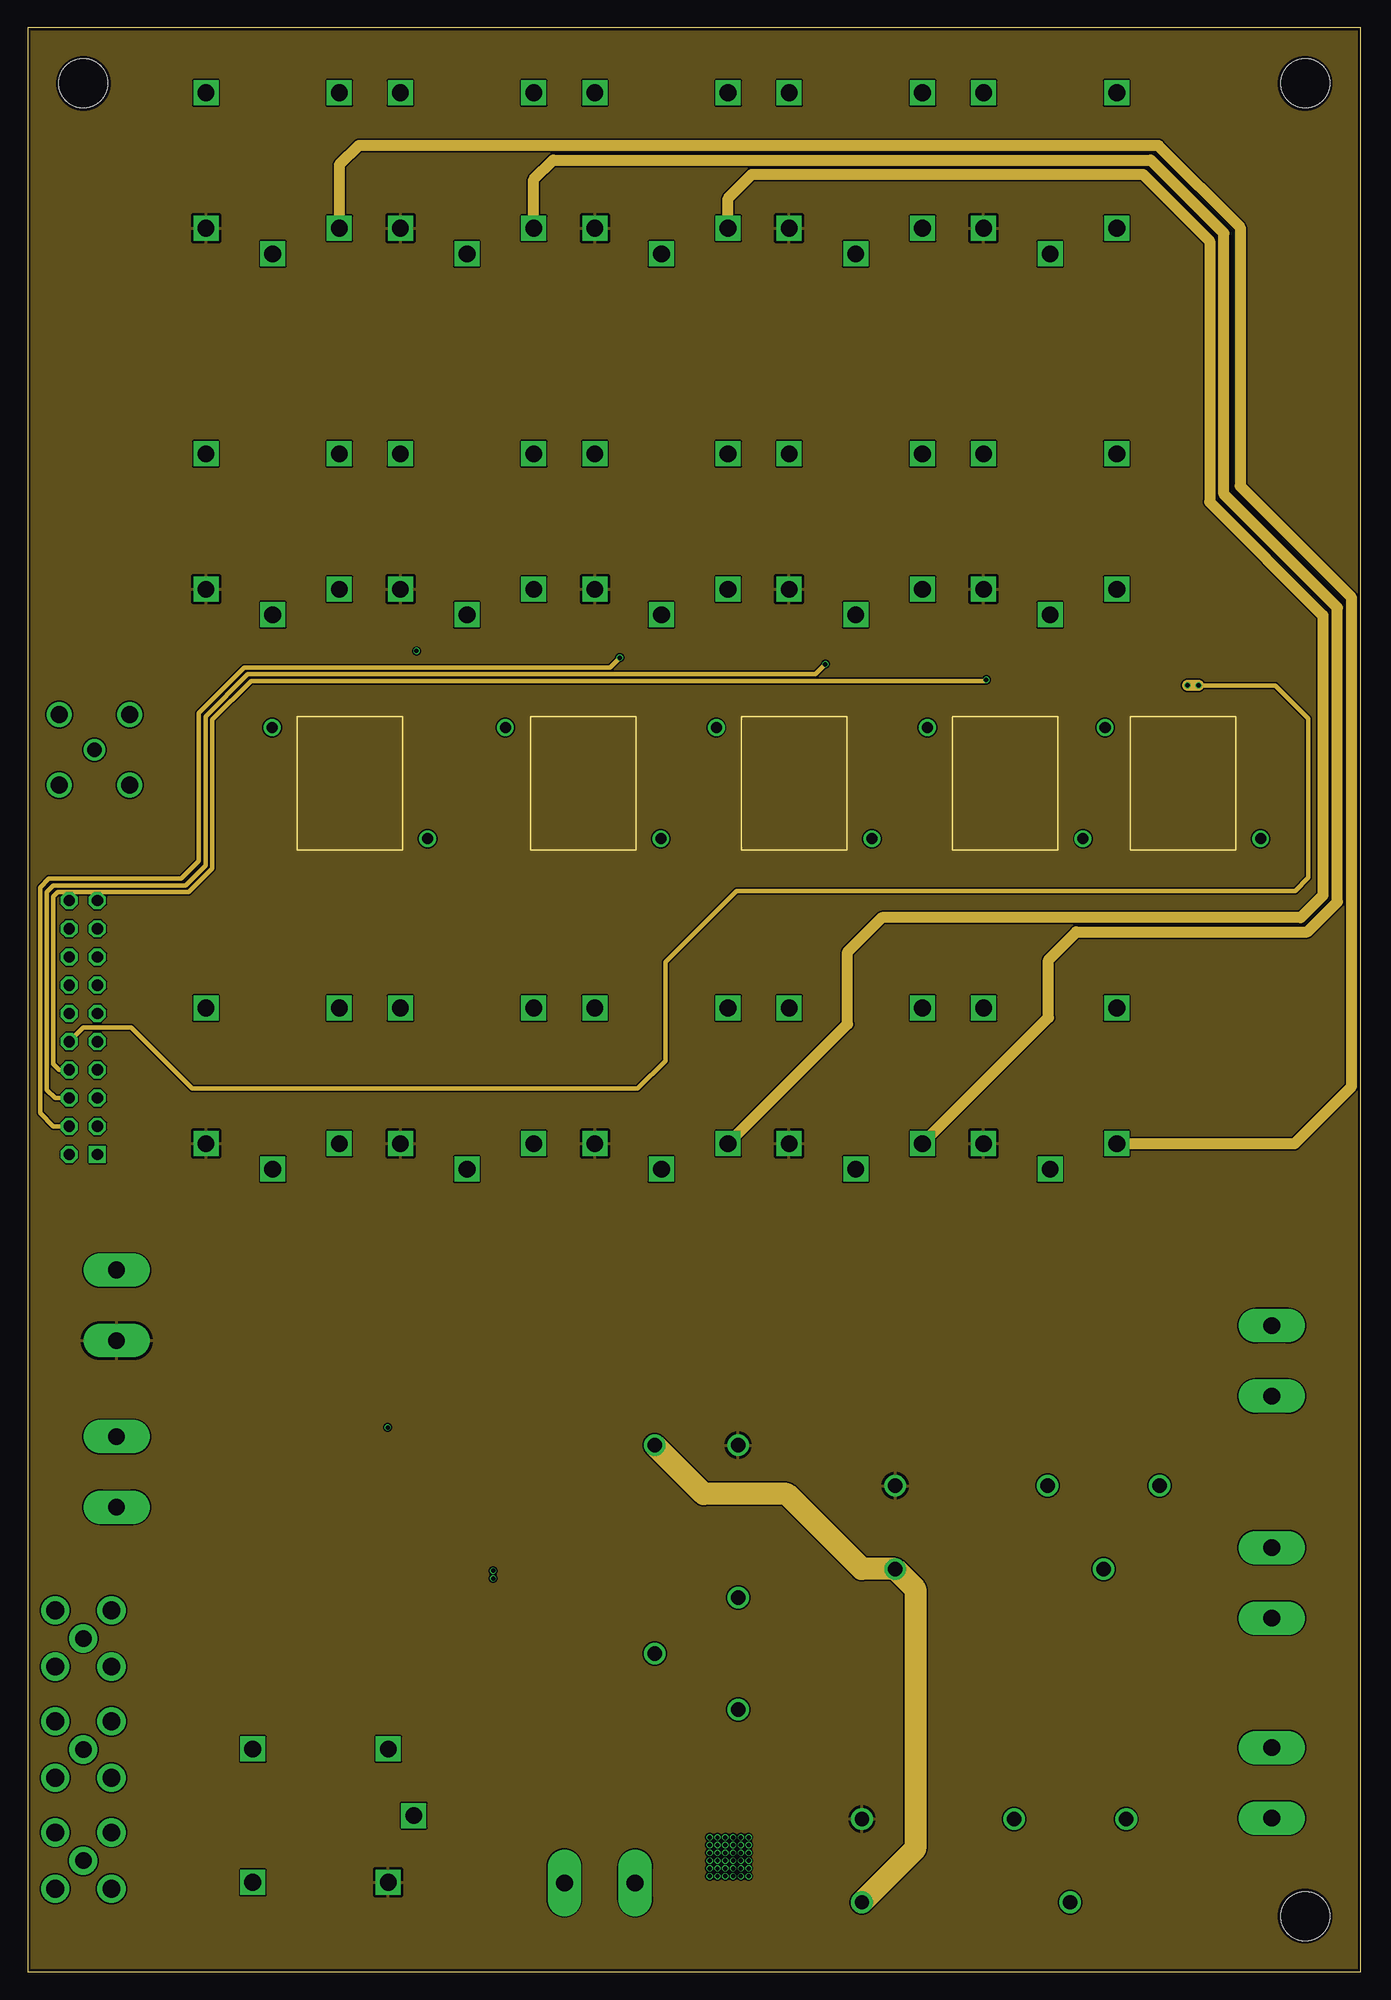
[diagram p5: board, inner layer Route2]
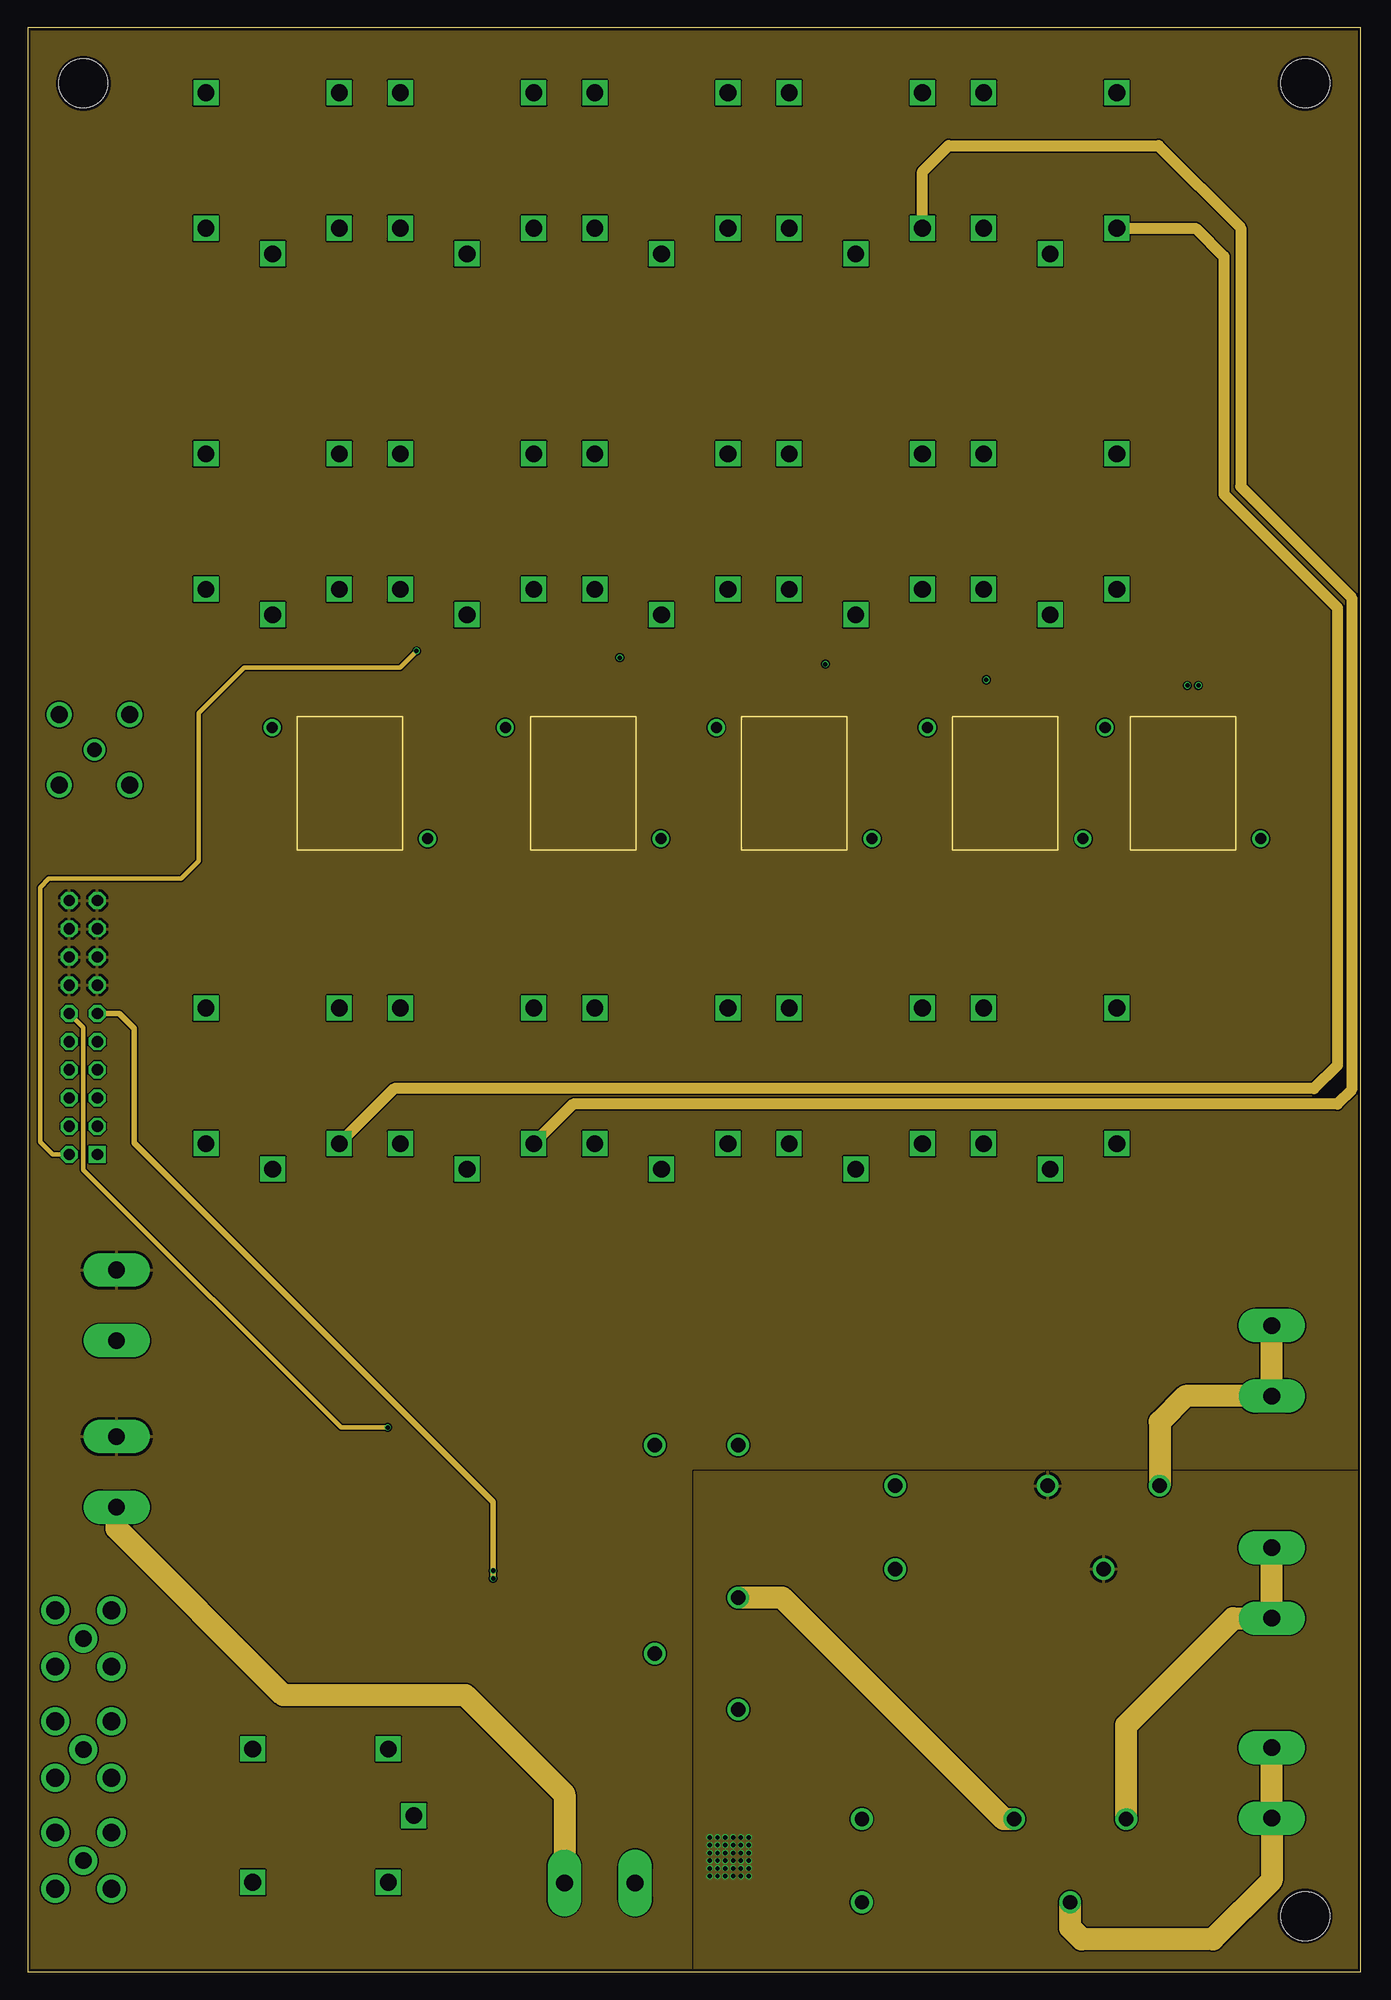
[diagram p6: board, inner layer Route3]
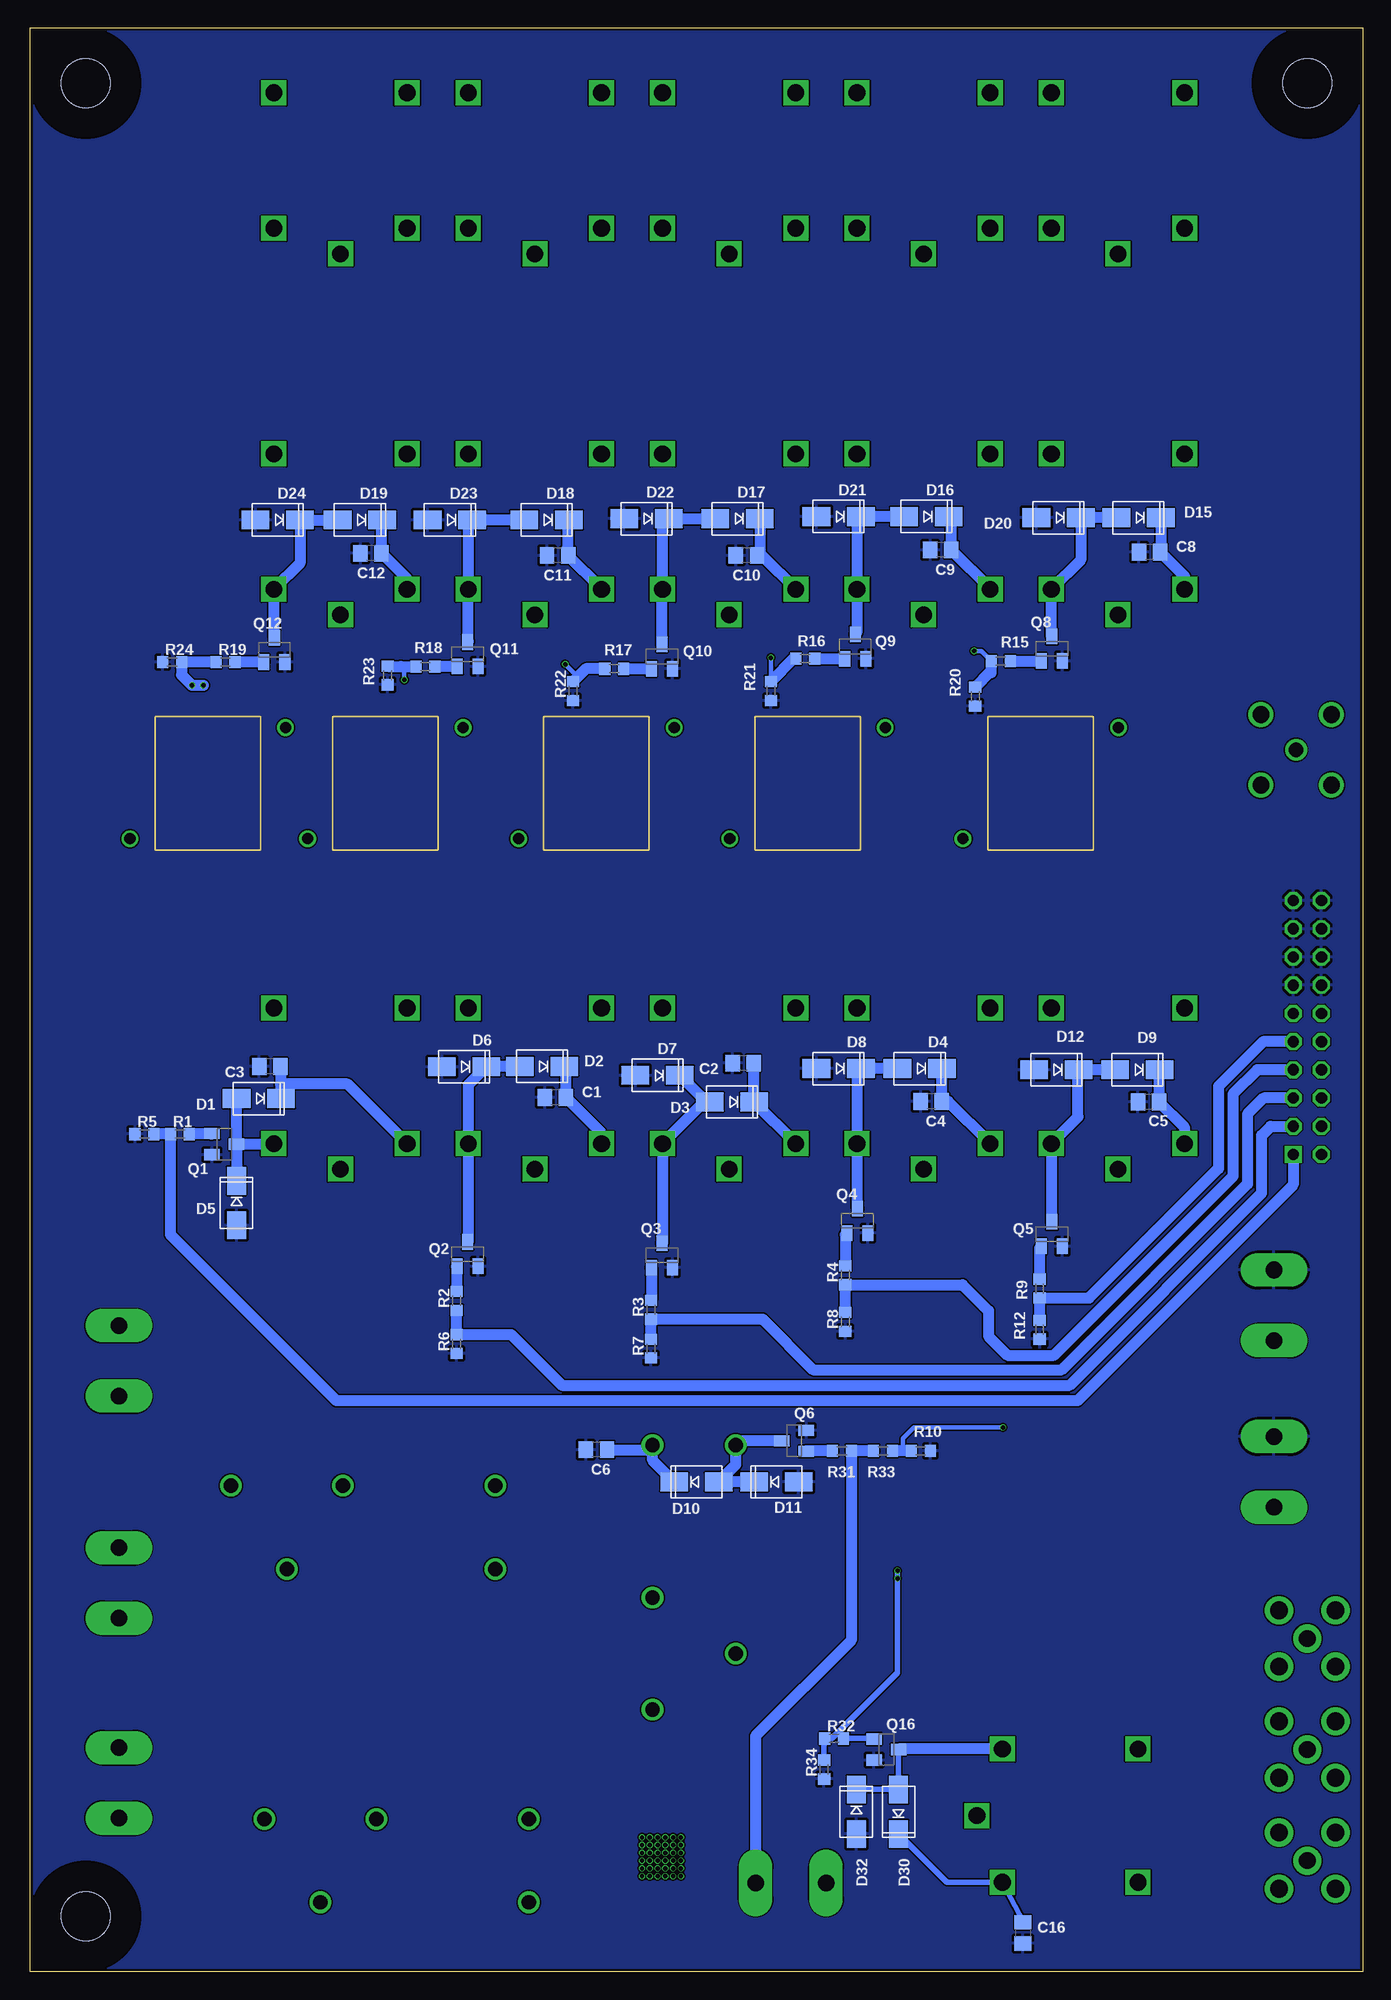
[diagram p7: board, bottom side, seen from below]

Size 120 x 175 mm. Coordinates in mm from the lower left corner, seen from the top.
Outline: 0,0 120,0 120,175 0,175 0,0
Copper layers (1+2*3+16): Top 0.035mm / dielectric 0.3mm / Route2 0.035mm / dielectric 1mm / Route3 0.035mm / dielectric 0.3mm / Bottom 0.035mm
Design rules "dirtyPCBdru4layer": minimum track width 3.5mil, minimum drill 0.2mm, track to track 3.5mil, track to pad 3.5mil, pad to pad 3.5mil, via to via 3.5mil, smd to smd 0mil, copper to edge 10mil, drill to drill 10mil, minimum pad ring 10mil, minimum via ring 0.08mm, stop-mask expansion 2mil, vias tented up to drill 25mil, thermal gap 10mil
Holes 4.4 mm at 5,170 115,170 115,5
tRestrict: area 0,165 to 10,175; area 110,165 to 120,175; area 110,0 to 120,10
bRestrict: area 0,165 to 10,175; area 110,165 to 120,175; area 110,0 to 120,10
vRestrict: area 0,165 to 10,175; area 110,165 to 120,175; area 110,0 to 120,10

### Footprints (pad centres in the part's own frame; a part is rotated, then mirrored left to right if it is on the bottom)
C0805 = smd 1.3 x 1.5: 1 -0.95,0; 2 0.95,0
C1812 = smd 1.9 x 3.4: 1 -1.95,0; 2 1.95,0
SMA/DO-214AC = smd 2.5 x 1.7: A 2,0; C -2,0
12A-5MM = drill 1.3: 11 6.86,-3.75; 12 1.82,3.75; 14 11.9,3.75; A1 -11.9,3.75; A2 -11.9,-3.75
T80-6 = drill 1: 1 -7,5; 2 7,-5
DIL-100-2X10 = drill 1.016 square: 1 -11.43,-1.27 | drill 1.016 octagon: 2 -11.43,1.27; 3 -8.89,-1.27; 4 -8.89,1.27; 5 -6.35,-1.27; 6 -6.35,1.27; 7 -3.81,-1.27; 8 -3.81,1.27; 9 -1.27,-1.27; 10 -1.27,1.27; 11 1.27,-1.27; 12 1.27,1.27; 13 3.81,-1.27; 14 3.81,1.27; 15 6.35,-1.27; 16 6.35,1.27; 17 8.89,-1.27; 18 8.89,1.27; 19 11.43,-1.27; 20 11.43,1.27
SOT23 = smd 1 x 1.4: 1 -0.95,-1.1; 2 0.95,-1.1; 3 0,1.1
R0603 = smd 1 x 1.1: 1 -0.85,0; 2 0.85,0
R2512 = smd 1.8 x 3.2: 1 -2.8,0; 2 2.8,0
SPDT = drill 1.5 square: 1 2.25,8.25; 2 4.55,2.25; 3 16.75,2.25; 4 16.75,14.25; 5 4.55,14.25
SMA90_DIP = drill 1.5 pad 2.54: ANTENNA 0,0 | drill 1.6 pad 2.54: GND1 -2.54,2.54; GND2 2.54,2.54; GND3 -2.54,-2.54; GND4 2.54,-2.54
AKL701_2_15 = drill 1.5 pad 3 long: 1 -3.175,0; 2 3.175,0
112404 = drill 1.3: 1 0,0 | drill 1.5: 2 -3.175,3.175; 3 3.175,3.175; 4 3.175,-3.175; 5 -3.175,-3.175

### Placement (x,y rotation side)
C1  72.7,78.7 180 bottom
C2  55.8,81.8 180 bottom
C3  98.4,81.5 180 bottom
C4  38.86,78.35 180 bottom
C5  19.3,78.3 180 bottom
C6  69,47 180 bottom
C8  19.2,127.8 180 bottom
C9  38,128 180 bottom
C10  55.5,127.5 180 bottom
C11  72.5,127.5 180 bottom
C12  89.3,127.7 180 bottom
C16  30.6,3.5 270 bottom
C17  22.1,148 270 top
C18  39.6,148 270 top
C19  57.1,147.9 270 top
C20  74.6,147.9 270 top
C21  91.9,148 270 top
C24  13.9,95.1 180 top
C25  13.9,100.6 180 top
C26  92,66 270 top
C27  74.6,66 270 top
C28  57.1,66 270 top
C29  39.41,66 270 top
C30  22.1,66 270 top
D1  99.4,78.6 180 bottom
D2  73.9,81.5 180 bottom
D3  56.8,78.3 180 bottom
D4  39.9,81.3 180 bottom
D5  101.4,69.2 270 bottom
D6  80.92,81.47 180 bottom
D7  63.5,80.7 180 bottom
D8  47.2,81.3 180 bottom
D9  20.3,81.2 180 bottom
D10  60,44.1 0 bottom
D11  52.8,44.1 0 bottom
D12  27.6,81.2 180 bottom
D15  20.2,130.9 180 bottom
D16  39.3,131 180 bottom
D17  56.3,130.8 180 bottom
D18  73.5,130.7 180 bottom
D19  90.3,130.7 180 bottom
D20  27.4,130.9 180 bottom
D21  47.2,131 180 bottom
D22  64.5,130.8 180 bottom
D23  82.2,130.7 180 bottom
D24  97.7,130.7 180 bottom
D30  41.8,14.4 90 bottom
D32  45.6,14.4 270 bottom
K1  87,10 0 top
K2  60.2,35.5 270 top
K3  90,40 0 top
L1  29,107 0 top
L2  50,107 0 top
L3  69,107 0 top
L4  88,107 0 top
L5  104,107 0 top
P1  5,85 90 top
Q1  102.5,74.5 270 bottom
Q2  80.6,64.6 0 bottom
Q3  63.1,64.5 0 bottom
Q4  45.5,67.6 0 bottom
Q5  28,66.4 0 bottom
Q6  51.2,47.8 90 bottom
Q8  28,119.1 0 bottom
Q9  45.7,119.3 0 bottom
Q10  63.1,118.4 0 bottom
Q11  80.6,118.6 0 bottom
Q12  98,119 0 bottom
Q16  42.9,20 270 bottom
R1  106.5,75.4 0 bottom
R2  81.6,60.4 90 bottom
R3  64.1,59.6 90 bottom
R4  46.6,62.7 90 bottom
R5  109.7,75.4 0 bottom
R6  81.6,56.5 90 bottom
R7  64.1,56.09 90 bottom
R8  46.6,58.5 90 bottom
R9  29.1,61.5 90 bottom
R10  39.8,46.9 180 bottom
R12  29.1,57.8 90 bottom
R15  32.6,118 0 bottom
R16  50.2,118.2 0 bottom
R17  67.4,117.3 0 bottom
R18  84.4,117.5 0 bottom
R19  102.4,117.9 0 bottom
R20  34.9,114.8 90 bottom
R21  53.3,115.3 90 bottom
R22  71.1,115.3 90 bottom
R23  87.8,116.7 90 bottom
R24  107.2,117.9 0 bottom
R29  15.6,25.1 0 top
R30  12.8,29.6 270 top
R31  46.9,46.9 180 bottom
R32  47.6,21 0 bottom
R33  43.2,46.9 180 bottom
R34  48.5,18.2 90 bottom
RL1  30.3,152.4 90 top
RL2  100.3,70 90 top
RL3  47.8,152.4 90 top
RL4  82.8,70 90 top
RL5  65.3,152.4 90 top
RL6  65.3,70 90 top
RL7  82.8,152.4 90 top
RL8  47.8,70 90 top
RL9  100.3,152.4 90 top
RL10  30.3,70 90 top
RL15  30.3,119.9 90 top
RL16  47.8,119.9 90 top
RL17  65.3,119.9 90 top
RL18  82.8,119.9 90 top
RL19  100.3,119.9 90 top
RL22  37,22.3 180 top
X1  5,10 90 top
X2  5,20 90 top
X3  112,17 90 top
X4  112,35 90 top
X5  5,30 90 top
X6  112,55 90 top
X7  51.5,8 0 top
X8  6,110 0 top
X9  8,45 270 top
X10  8,60 270 top

### Tracks (layer width: path | path; a pad name or v marks a point on that pad's centre or on a via)
+5V
  Route3 2: X7.1 48.33,15.97 39.4,24.9 23,24.9 8,39.9 X9.2
+12V
  Bottom 0.5: D30.C 37.45,8.05 RL22.5 30.55,4.5 C16.1
  Bottom 1: C3.1 97.45,79.9 | 97.45,79.9 97.45,78.65 D1.C | RL2.5 91.4,79.9 97.45,79.9 | D2.C 71.75,81.35 C1.1 68.55,75.5 RL4.5 | RL6.5 D3.C 54.8,81.75 C2.1 | RL8.5 37.35,78.35 C4.1 D4.C | RL10.5 16.05,76 C5.1 18.35,81.15 D9.C | D15.C 18.2,127.85 C8.1 16.05,125.6 RL15.5 | RL16.5 33.55,124.5 C9.1 37.05,130.75 D16.C | D17.C 54.3,127.75 C10.1 54.1,127.5 RL17.5 | RL18.5 68.55,124.5 C11.1 71.55,130.65 D18.C | D19.C 88.35,130.65 C12.1 86.05,125.4 RL19.5 | C6.1 64.35,47 K2.A1 63.95,46.05 D10.C
  pour Route2 (rank 5): -1.2,-1.2 121.2,-1.2 121.2,176.2 -1.2,176.2
ARDUINO_PTT  (via drill 0.4)
  Route3 0.4: P1.12 5,85 5,72.2 28.2,49 v32.4,49
  Bottom 0.4: v32.4,49 40.4,49 41.4,48 41.4,46.9
  Bottom 1: R10.2 41.4,46.9 R33.1
GND
  pour Bottom: -1.6,-1.6 121.6,-1.6 121.6,176.6 -1.6,176.6
  pour Route3 (rank 2): -1.4,-1.4 121.4,-1.4 121.4,176.4 -1.4,176.4
INPUT_AMP_RF
  Top 2: 63.05,172.8 80.55,172.8 | RL3.3 45.55,172.8 | 45.55,172.8 31.7,172.8 RL1.3 27.95,169.15 22.6,163.8 13.4,163.8 9.6,160 9.6,135.9 13.3,132.2 17.9,132.2 22.05,128.05 RL15.1 22,122.1 L1.1 | RL5.3 63.05,172.8 | RL7.3 80.55,172.8 | 80.55,172.8 94.4,172.8 RL9.3 104.55,169.15 115.8,157.9 115.8,71.6 86.5,42.3 86.5,30 81.7,25.2 65.55,25.2 K2.14 | 45.55,172.8 63.05,172.8
INPUT_CAP_CTRL_0
  Bottom 1: R5.2 R1.1 107.35,66.35 92.4,51.4 25.7,51.4 6.27,70.83 P1.1
INPUT_CAP_CTRL_1
  Bottom 1: R2.1 R6.2 76.65,57.35 72.1,52.8 26.4,52.8 9.1,70.1 9.1,75.3 8.29,76.11 P1.3
INPUT_CAP_CTRL_2
  Bottom 1: R7.2 R3.1 54.05,58.75 49.5,54.2 27.1,54.2 10.4,70.9 10.4,77.2 8.95,78.65 P1.5
INPUT_CAP_CTRL_3
  Bottom 1: R8.2 R4.1 36.05,61.85 33.7,59.5 33.7,57.2 32,55.5 27.8,55.5 11.7,71.6 11.7,79 9.51,81.19 P1.7
INPUT_CAP_CTRL_4
  Bottom 1: R12.2 R9.1 24.65,60.65 13,72.3 13,79.7 8.97,83.73 P1.9
INPUT_INDUCT_CTRL_0  (via drill 0.4)
  Route3 0.4: v35,118.9 33.5,117.4 19.5,117.4 15.4,113.3 15.4,100 13.8,98.4 1.9,98.4 1.1,97.6 1.1,74.7 2.23,73.57 P1.2
  Bottom 0.4: R15.1 34.35,118.9 v35,118.9
  Bottom 1: R15.1 33.45,116.95 33.6,116.95 R20.2
INPUT_INDUCT_CTRL_1  (via drill 0.4)
  Route2 0.4: v53.3,118.3 52.4,117.4 19.5,117.4 15.4,113.3 15.4,100 13.8,98.4 1.9,98.4 1.1,97.6 1.1,77.3 2.29,76.11 P1.4
  Bottom 0.4: v53.3,118.3 R21.2
  Bottom 1: R16.1 51.25,118.2 R21.2
INPUT_INDUCT_CTRL_2  (via drill 0.4)
  Route2 0.4: v71.81,117.71 70.9,116.8 19.8,116.8 16,113 16,99.6 14.2,97.8 2.3,97.8 1.7,97.2 1.7,79.4 2.45,78.65 P1.6
  Bottom 0.4: v71.81,117.71 70.88,116.78 70.47,116.78
  Bottom 1: R17.1 69.95,117.3 70.47,116.78 R22.2
INPUT_INDUCT_CTRL_3  (via drill 0.4)
  Route2 0.4: v86.3,116.3 86.2,116.2 20.1,116.2 16.6,112.7 16.6,99.3 14.5,97.2 2.7,97.2 2.3,96.8 2.3,81.7 2.81,81.19 P1.8
  Bottom 0.4: v86.3,116.3 86.3,117.2 86.6,117.5
  Bottom 1: R23.2 87.75,117.5 86.6,117.5 R18.1
INPUT_INDUCT_CTRL_4  (via drill 0.4)
  Route2 0.4: v105.4,115.8 112.3,115.8 115.3,112.8 115.3,98.5 114.1,97.3 63.8,97.3 57.4,90.9 57.4,82 54.9,79.5 14.8,79.5 9.3,85 5,85 P1.10
  Route2 1: v105.4,115.8 v104.4,115.8
  Bottom 1: R19.1 R24.2 106.35,116.75 v105.4,115.8 v104.4,115.8
INPUT_RELAY_CTRL  (via drill 0.4)
  Route3 0.5: P1.11 8.23,86.27 9.6,84.9 9.6,74.6 41.9,42.3 v41.9,36.1 v41.9,35.4
  Bottom 0.5: R34.2 48.5,20.95 R32.1 47.8,21 41.9,26.9 v41.9,35.4 v41.9,36.1
INPUT_RF_POST_L
  Top 2: RL19.3 111,123.7 L5.2 111,91.6 98,91.6 | 98,91.6 80.6,91.6 | 80.6,91.6 63.1,91.6 | 63.1,91.6 45.5,91.6 | 45.5,91.6 30.5,91.6 | RL10.3 28.05,89.15 30.5,91.6 | RL8.3 45.55,91.55 45.5,91.6 | RL6.3 63.05,91.55 63.1,91.6 | RL4.3 80.55,91.55 80.6,91.6 | RL2.3 98.05,91.55 98,91.6 | C25.1 C24.1 19.35,91.6 30.5,91.6
N$1
  Route2 2: K2.A2 60.85,43 68.35,43 75.1,36.25 K3.A2 79.9,34.45 79.9,11.05 K1.A2
  Bottom 1: D11.C D10.A 56.45,45.65 K2.A2 56.05,47.8 Q6.3
N$2
  Route3 2: K2.12 67.92,33.68 87.85,13.75 K1.12
N$3
  Route3 2: X3.2 X3.1 112,8.2 106.7,2.9 94.9,2.9 93.86,3.94 K1.11
N$5
  Bottom 1: R31.2 50.05,46.9 Q6.1
N$15
  Bottom 0.5: Q16.3 D30.A D32.C
  Bottom 1: RL22.2 41.75,20.05 Q16.3
N$29
  Bottom 0.5: R32.2 44.05,21 Q16.1
N$33
  Top 1: X5.ANTENNA 9.1,30 12.8,26.3 R29.1 R30.2
N$53
  Bottom 1: D16.A D21.C 45.55,130.65 RL16.2 45.55,120.55 Q9.3
N$64
  Bottom 1: R16.2 Q9.1
N$67
  Bottom 1: D17.A D22.C 63.05,130.25 RL17.2 63.1,124.4 Q10.3
N$80
  Bottom 1: R17.2 Q10.1
N$100
  Top 2: C17.1 22.1,154.6 RL1.1
N$101
  Top 1: X1.ANTENNA 9.4,10 13.45,14.05 RL22.1
N$102
  Bottom 1: D18.A D23.C 80.55,130.35 RL18.2 80.55,119.75 Q11.3
N$103
  Top 2: C26.1 92,72.2 RL2.1
N$107
  Top 2: C27.1 74.55,68 RL4.1
N$108
  Top 2: C28.1 57.1,72.2 RL6.1
N$109
  Top 2: C29.1 39.41,72.11 RL8.1
N$110
  Top 2: C30.1 22.1,72.2 RL10.1
N$111
  Bottom 1: Q11.1 R18.2
N$114
  Bottom 1: D19.A D24.C 95.7,126.8 RL19.2 98,124.4 Q12.3
N$115
  Bottom 1: Q12.1 R19.2
N$120
  Route2 1: RL1.2 28.05,162.65 29.8,164.4 101.8,164.4 109.15,157.05 109.15,133.75 119.2,123.7 119.2,79.7 114.05,74.55 RL2.2
  Bottom 1: Q1.3 98.1,74.5 RL2.2 | Q1.3 D5.C | Q1.3 D1.A
N$121
  Bottom 1: Q1.1 103.65,75.4 R1.2
N$142
  Route2 1: RL3.2 45.55,161.35 47.3,163.1 101.1,163.1 107.7,156.5 107.7,133 117.9,122.8 117.9,96.3 115.2,93.6 94.4,93.6 91.9,91.1 91.9,85.9 RL4.2
  Bottom 1: D2.A 78.89,81.5 D6.C 80.55,79.84 RL4.2 80.55,65.75 Q2.3
N$143
  Bottom 1: Q2.1 81.6,63.45 R2.2
N$144
  Route3 1: RL7.2 80.55,162.05 82.9,164.4 101.8,164.4 109.2,157 109.2,133.7 119.2,123.7 119.2,79.4 117.9,78.1 49.1,78.1 RL8.2
  Bottom 1: D4.A D8.C 45.55,80.95 RL8.2 45.5,74.5 Q4.3
N$145
  Bottom 1: Q4.1 46.6,66.35 R4.2
N$146
  Route3 1: RL9.2 105.15,156.95 107.7,154.4 107.7,133 117.9,122.8 117.9,81.6 115.8,79.5 33,79.5 RL10.2
  Bottom 1: D9.A D12.C 25.65,81.2 25.65,76.95 RL10.2 28,74.5 Q5.3
N$147
  Bottom 1: R9.2 29.1,65.15 Q5.1
N$151
  Top 2: C18.1 39.6,154.6 RL3.1
N$152
  Route2 1: RL5.2 63.05,159.65 65.2,161.8 100.4,161.8 106.4,155.8 106.4,132.3 116.6,122.1 116.6,96.9 114.6,94.9 76.9,94.9 73.8,91.8 73.8,85.3 RL6.2
  Bottom 1: D7.C 59.1,78.3 D3.A 59.3,78.3 RL6.2 63.05,65.65 Q3.3
N$153
  Bottom 1: Q3.1 64.05,60.5 R3.2
N$164
  Bottom 1: D15.A D20.C 25.4,127.1 RL15.2 28.05,120.25 Q8.3
N$167
  Top 2: C19.1 57.1,154.6 RL5.1
N$168
  Top 2: C21.1 91.9,154.5 RL9.1
N$169
  Bottom 1: R15.2 Q8.1
N$187
  Bottom 1: R33.2 R31.1 46.05,29.85 54.67,21.23 X7.2
N$190
  Top 1: X2.ANTENNA 20.2,20 RL22.3
  Top 2: K2.11 21.94,28.64 R29.2 18.4,21.9 RL22.3
N$302
  Top 2: C20.1 74.6,154.6 RL7.1
N$321
  Top 2: RL18.3 80.55,132.55 82.5,130.6 90.1,130.6 92.05,128.65 RL19.1 97,117.2 L5.1 97,104 L4.2
N$322
  Top 2: RL17.3 63.05,132.95 64.5,131.5 73,131.5 74.55,129.95 RL18.1 81,115.7 L4.1 81,107 L3.2
N$332
  Top 2: RL16.3 45.55,133.65 48.1,131.1 54.7,131.1 57.05,128.75 RL17.1 62,117.2 L3.1 62,110.3 57,105.3 L2.2
N$333
  Top 2: RL15.3 28.05,133.35 30,131.4 37.4,131.4 39.55,129.25 RL16.1 39.55,115.45 L2.1 43,109 L1.2
RF_AMP_OUT
  Route3 2: X4.2 X4.1 108.53,31.82 98.9,22.2 K1.14
RF_FILT_IN
  Top 2: C24.2 C25.2 9.4,100.6 6,104 X8.1
VALVE_GND  (via drill 0.4)
  other vias: 61.4,10 62.1,10 62.8,10 61.4,10.7 62.1,10.7 62.8,10.7 61.4,8.6 62.1,8.6 62.8,8.6 61.4,9.3 62.1,9.3 62.8,9.3 63.5,10 64.2,10 64.9,10 63.5,10.7 64.2,10.7 64.9,10.7 63.5,8.6 64.2,8.6 64.9,8.6 63.5,9.3 64.2,9.3 64.9,9.3 61.4,11.4 62.1,11.4 62.8,11.4 61.4,12.1 62.1,12.1 62.8,12.1 63.5,11.4 64.2,11.4 64.9,11.4 63.5,12.1 64.2,12.1 64.9,12.1
  pour Top: -1,-1 121,-1 121,176 -1,176
  pour Route3: 60,-1.4 121.4,-1.4 121.4,45 60,45
VALVE_PTT
  Route3 2: K3.14 101.9,49.5 104.22,51.83 X6.1 X6.2

### Text on the board
Top: RF-INP-001
tNames: GND | +12V | RF-INP-001 | GND | +5V | RF Output For SDR | Amplified RF Output | RF Output / For VNA | Antenna Header | RF Input